# Altium project tcspc00.PrjPcb (part 1 of 2)
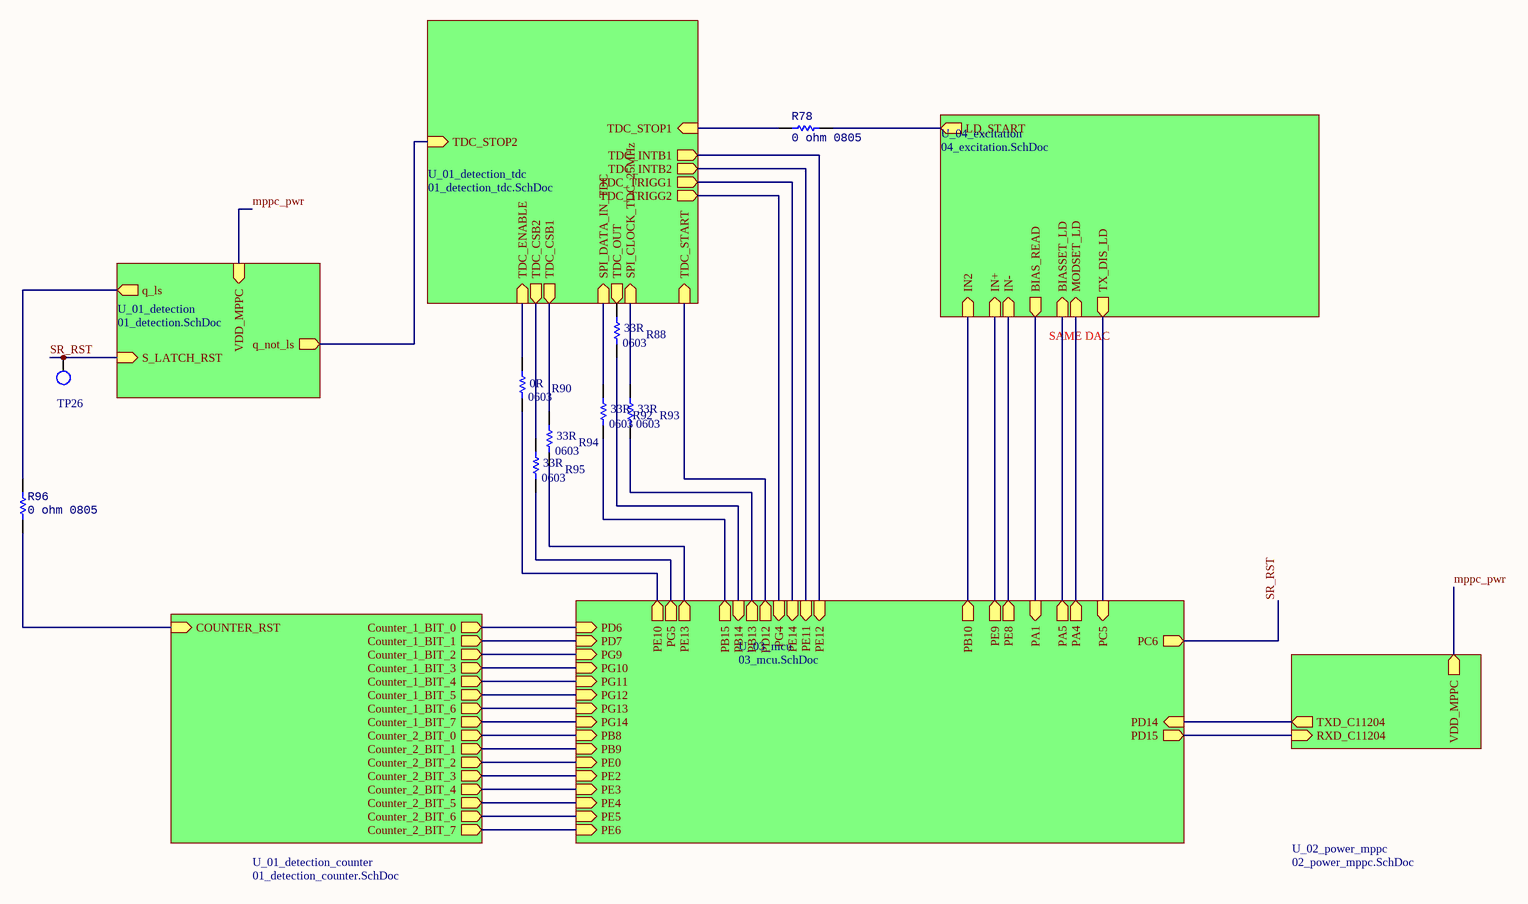
[diagram p0: 00_cover_sheet.SchDoc]
16 sheets, 354 parts. Net scope: hierarchical (ports join the sheet entries above them; power ports are global).
Board file: tcspc01.PcbDoc
Sheets:
  00_cover_sheet.SchDoc
    U_01_detection = 01_detection.SchDoc
    U_02_power_mppc = 02_power_mppc.SchDoc
    U_01_detection_tdc = 01_detection_tdc.SchDoc
    U_04_excitation = 04_excitation.SchDoc
    U_03_mcu = 03_mcu.SchDoc
      U_03_mcu_oscillators = 03_mcu_oscillators.SchDoc
      U_03_mcu_switches = 03_mcu_switches.SchDoc
      U_03_mcu_display = 03_mcu_display.SchDoc
      U_03_mcu_io = 03_mcu_io.SchDoc
      U_02_power_supply = 02_power_supply.SchDoc
        U_02_ldo1v8 = 02_ldo1v8.SchDoc
        U_02_boost3v3D = 02_boost3v3D.SchDoc
        U_02_boost5v = 02_boost5v.SchDoc
        U_02_ldo5v5 = 02_ldo5v5.SchDoc
    U_01_detection_counter = 01_detection_counter.SchDoc

## Sheet 00_cover_sheet.SchDoc
size A3; SheetNumber: 1; SheetTotal: 17

### Parts
R78  0 ohm 0805  [RES-STACK-POLE-0805]
R88  RMCF0603JT33R0  [RES-STACK-POLE-0603]  (value not drawn)
R90  RMCF0603ZT0R00  [RES-STACK-POLE-0603]  (value not drawn)
R92  RMCF0603JT33R0  [RES-STACK-POLE-0603]  (value not drawn)
R93  RMCF0603JT33R0  [RES-STACK-POLE-0603]  (value not drawn)
R94  RMCF0603JT33R0  [RES-STACK-POLE-0603]  (value not drawn)
R95  RMCF0603JT33R0  [RES-STACK-POLE-0603]  (value not drawn)
R96  0 ohm 0805  [RES-STACK-POLE-0805]
TP26  TESTPOINT_S  [TESTPOINT_S]  (value not drawn)  (no BOM)

### Sub-sheets
U_01_detection = 01_detection.SchDoc: VDD_MPPC (in), S_LATCH_RST (in), q_ls (out), q_not_ls (out)
U_01_detection_counter = 01_detection_counter.SchDoc: COUNTER_RST (in), Counter_1_BIT_0 (out), Counter_1_BIT_1 (out), Counter_1_BIT_2 (out), Counter_1_BIT_3 (out), Counter_1_BIT_4 (out), Counter_1_BIT_5 (out), Counter_1_BIT_6 (out), Counter_1_BIT_7 (out), Counter_2_BIT_0 (out), Counter_2_BIT_1 (out), Counter_2_BIT_2 (out), Counter_2_BIT_3 (out), Counter_2_BIT_4 (out), Counter_2_BIT_5 (out), Counter_2_BIT_6 (out), Counter_2_BIT_7 (out)
U_01_detection_tdc = 01_detection_tdc.SchDoc: TDC_ENABLE (in), SPI_CLOCK_TDC_25MHz (in), SPI_DATA_IN_TDC (in), TDC_INTB1 (out), TDC_INTB2 (out), TDC_TRIGG1 (out), TDC_TRIGG2 (out), TDC_CSB1 (out), TDC_CSB2 (out), TDC_STOP2 (in), TDC_STOP1 (in), TDC_START (in), TDC_OUT (out)
U_02_power_mppc = 02_power_mppc.SchDoc: RXD_C11204 (in), TXD_C11204 (out), VDD_MPPC (out)
U_03_mcu = 03_mcu.SchDoc: PE2 (in), PE3 (in), PE4 (in), PE5 (in), PE6 (in), PB10 (out), PE14 (in), PE13 (out), PE12 (in), PE11 (in), PE10 (out), PE9 (out), PE8 (out), PC5 (in), PA5 (out), PA4 (out), PB13 (out), PB14 (in), PB15 (out), PD12 (out), PD14 (in), PD15 (out), PG4 (in), PG5 (out), PC6 (out), PD6 (in), PD7 (in), PG9 (in), PG10 (in), PG11 (in), PG12 (in), PG13 (in), PG14 (in), PB8 (in), PB9 (in), PE0 (in), PA1 (in)
U_04_excitation = 04_excitation.SchDoc: MODSET_LD (in), BIASSET_LD (in), TX_DIS_LD (out), IN- (in), BIAS_READ (out), IN2 (in), IN+ (in), LD_START (out)

### Nets
Counter_1_BIT_0: sheet U_03_mcu/PD6, sheet U_01_detection_counter/Counter_1_BIT_0
Counter_1_BIT_1: sheet U_03_mcu/PD7, sheet U_01_detection_counter/Counter_1_BIT_1
Counter_1_BIT_2: sheet U_03_mcu/PG9, sheet U_01_detection_counter/Counter_1_BIT_2
Counter_1_BIT_3: sheet U_03_mcu/PG10, sheet U_01_detection_counter/Counter_1_BIT_3
Counter_1_BIT_4: sheet U_03_mcu/PG11, sheet U_01_detection_counter/Counter_1_BIT_4
Counter_1_BIT_5: sheet U_03_mcu/PG12, sheet U_01_detection_counter/Counter_1_BIT_5
Counter_1_BIT_6: sheet U_03_mcu/PG13, sheet U_01_detection_counter/Counter_1_BIT_6
Counter_1_BIT_7: sheet U_03_mcu/PG14, sheet U_01_detection_counter/Counter_1_BIT_7
Counter_2_BIT_0: sheet U_03_mcu/PB8, sheet U_01_detection_counter/Counter_2_BIT_0
Counter_2_BIT_1: sheet U_03_mcu/PB9, sheet U_01_detection_counter/Counter_2_BIT_1
Counter_2_BIT_2: sheet U_03_mcu/PE0, sheet U_01_detection_counter/Counter_2_BIT_2
Counter_2_BIT_3: sheet U_03_mcu/PE2, sheet U_01_detection_counter/Counter_2_BIT_3
Counter_2_BIT_4: sheet U_03_mcu/PE3, sheet U_01_detection_counter/Counter_2_BIT_4
Counter_2_BIT_5: sheet U_03_mcu/PE4, sheet U_01_detection_counter/Counter_2_BIT_5
Counter_2_BIT_6: sheet U_03_mcu/PE5, sheet U_01_detection_counter/Counter_2_BIT_6
Counter_2_BIT_7: sheet U_03_mcu/PE6, sheet U_01_detection_counter/Counter_2_BIT_7
COUNTER_RST: R96.1 ; sheet U_01_detection_counter/COUNTER_RST
mppc_pwr: sheet U_01_detection/VDD_MPPC, sheet U_02_power_mppc/VDD_MPPC
RXD_C11204: sheet U_02_power_mppc/RXD_C11204, sheet U_03_mcu/PD15
SPI_CLOCK_TDC_25MHz: R93.2 ; sheet U_01_detection_tdc/SPI_CLOCK_TDC_25MHz
SPI_DATA_IN_TDC: R92.2 ; sheet U_01_detection_tdc/SPI_DATA_IN_TDC
SR_RST: TP26.1 ; sheet U_01_detection/S_LATCH_RST, sheet U_03_mcu/PC6  [project net S_LATCH_RST]
TDC_CSB1: R94.2 ; sheet U_01_detection_tdc/TDC_CSB1
TDC_CSB2: R95.2 ; sheet U_01_detection_tdc/TDC_CSB2
TDC_ENABLE: R90.2 ; sheet U_01_detection_tdc/TDC_ENABLE
TDC_INTB1: sheet U_01_detection_tdc/TDC_INTB1, sheet U_03_mcu/PE12
TDC_INTB2: sheet U_01_detection_tdc/TDC_INTB2, sheet U_03_mcu/PE11
TDC_TRIGG1: sheet U_01_detection_tdc/TDC_TRIGG1, sheet U_03_mcu/PE14
TDC_TRIGG2: sheet U_01_detection_tdc/TDC_TRIGG2, sheet U_03_mcu/PG4
TXD_C11204: sheet U_02_power_mppc/TXD_C11204, sheet U_03_mcu/PD14
NetC103_1: sheet U_04_excitation/BIASSET_LD, sheet U_03_mcu/PA5
NetC105_1: sheet U_04_excitation/MODSET_LD, sheet U_03_mcu/PA4
NetR65_2: sheet U_04_excitation/BIAS_READ, sheet U_03_mcu/PA1
NetR67_2: sheet U_04_excitation/IN-, sheet U_03_mcu/PE8
NetR70_1: R78.2 ; sheet U_04_excitation/IN+, sheet U_04_excitation/LD_START, sheet U_03_mcu/PE9
NetR78_1: R78.1 ; sheet U_01_detection_tdc/TDC_STOP1
NetR82_1: sheet U_04_excitation/IN2, sheet U_03_mcu/PB10
NetR88_1: R88.1 ; sheet U_03_mcu/PB14
NetR88_2: R88.2 ; sheet U_01_detection_tdc/TDC_OUT
NetR90_1: R90.1 ; sheet U_03_mcu/PE10
NetR92_1: R92.1 ; sheet U_03_mcu/PB15
NetR93_1: R93.1 ; sheet U_03_mcu/PB13
NetR94_1: R94.1 ; sheet U_03_mcu/PE13
NetR95_1: R95.1 ; sheet U_03_mcu/PG5
NetR96_2: R96.2 ; sheet U_01_detection/q_ls
NetTP18_1: sheet U_01_detection/q_not_ls, sheet U_01_detection_tdc/TDC_STOP2
NetTP39_1: sheet U_01_detection_tdc/TDC_START, sheet U_03_mcu/PD12
NetU17_45: sheet U_04_excitation/TX_DIS_LD, sheet U_03_mcu/PC5

### Notes on the sheet
- SAME DAC
- (in symbol RMCF0603JT33R0) 33R; 0603
- (in symbol RMCF0603ZT0R00) 0R; 0603

### Library data of the parts
R78 R96 = RC0805JR-070RL: RES 0 OHM JUMPER 1/8W 0805; Supplier 1: Digikey; Supplier Part Number 1: 311-0.0ARCT-ND
R88 R92-R95 = RMCF0603JT33R0: RES 33 OHM 5% 1/10W 0603; Supplier 1: Digi-Key; Supplier Part Number 1: RMCF0603JT33R0CT-ND
R90 = RMCF0603ZT0R00: RES 0 OHM JUMPER 1/10W 0603; Supplier 1: Digi-Key; Supplier Part Number 1: RMCF0603ZT0R00CT-ND
TP26 = TESTPOINT_S: Testpoint Surface Pad

## Sheet 01_detection.SchDoc
size A3; SheetNumber: 2; SheetTotal: 17
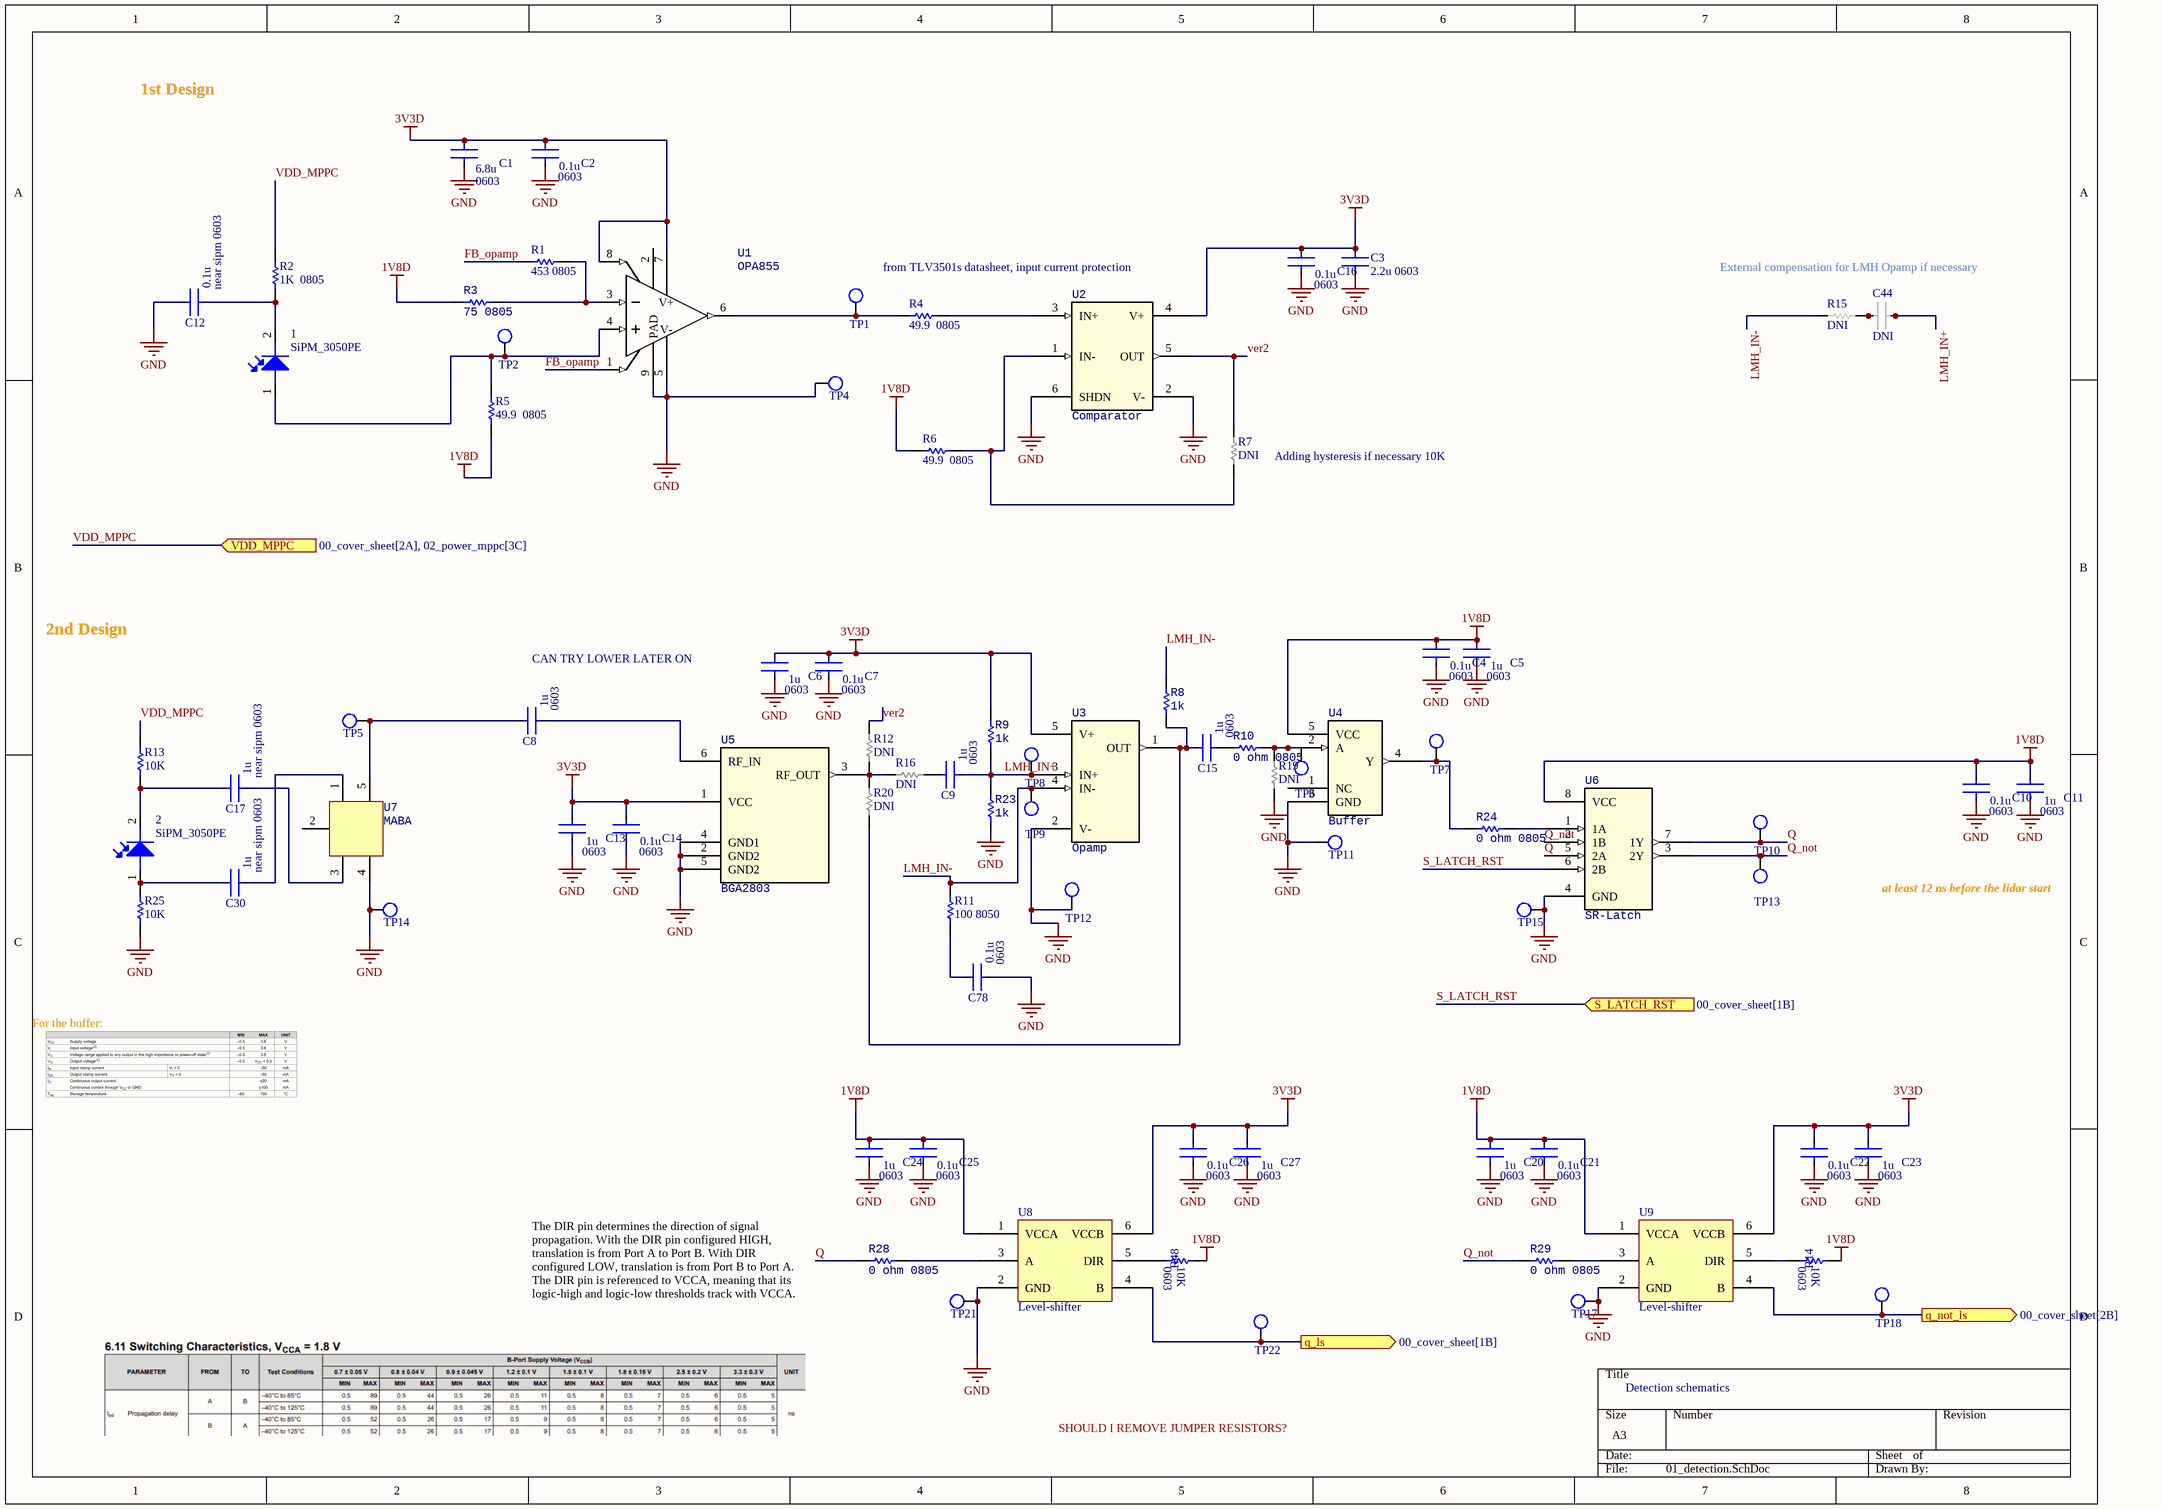
[diagram p1: 01_detection.SchDoc]

### Parts
1  SiPM_3050PE  [MPPC-S13360-3050PE]
2  SiPM_3050PE  [MPPC-S13360-3050PE]
C1  C1608X5R1E685K080AC  [CAPTDK0603]  (value not drawn)
C2  CGA3E2X7R1H104K080AA  [CAPTDK0603]  (value not drawn)
C3  2.2u 0603  [CAPTDK0603]
C4  CGA3E2X7R1H104K080AA  [CAPTDK0603]  (value not drawn)
C5  C1608X5R1E105K080AC  [CAPTDK0603]  (value not drawn)
C6  C1608X5R1E105K080AC  [CAPTDK0603]  (value not drawn)
C7  CGA3E2X7R1H104K080AA  [CAPTDK0603]  (value not drawn)
C8  C1608X5R1E105K080AC  [CAPTDK0603]  (value not drawn)
C9  C1608X5R1E105K080AC  [CAPTDK0603]  (value not drawn)
C10  CGA3E2X7R1H104K080AA  [CAPTDK0603]  (value not drawn)
C11  C1608X5R1E105K080AC  [CAPTDK0603]  (value not drawn)
C12  CL10B104KC8NNNC  [CAPTDK0603]  (value not drawn)
C13  C1608X5R1E105K080AC  [CAPTDK0603]  (value not drawn)
C14  CGA3E2X7R1H104K080AA  [CAPTDK0603]  (value not drawn)
C15  C1608X5R1E105K080AC  [CAPTDK0603]  (value not drawn)
C16  CGA3E2X7R1H104K080AA  [CAPTDK0603]  (value not drawn)
C17  GRM188D72A105KE01J  [CAPTDK0603]  (value not drawn)
C20  C1608X5R1E105K080AC  [CAPTDK0603]  (value not drawn)
C21  CGA3E2X7R1H104K080AA  [CAPTDK0603]  (value not drawn)
C22  CGA3E2X7R1H104K080AA  [CAPTDK0603]  (value not drawn)
C23  C1608X5R1E105K080AC  [CAPTDK0603]  (value not drawn)
C24  C1608X5R1E105K080AC  [CAPTDK0603]  (value not drawn)
C25  CGA3E2X7R1H104K080AA  [CAPTDK0603]  (value not drawn)
C26  CGA3E2X7R1H104K080AA  [CAPTDK0603]  (value not drawn)
C27  C1608X5R1E105K080AC  [CAPTDK0603]  (value not drawn)
C30  GRM188D72A105KE01J  [CAPTDK0603]  (value not drawn)
C44  DNI  [CAPTDK0603]  (no BOM)
C78  CGA3E2X7R1H104K080AA  [CAPTDK0603]  (value not drawn)
R1  453 0805  [RES-STACK-POLE-0805]
R2  1K  0805  [RES-STACK-POLE-0805]
R3  75 0805  [RES-STACK-POLE-0805]
R4  49.9  0805  [RES-STACK-POLE-0805]
R5  49.9  0805  [RES-STACK-POLE-0805]
R6  49.9  0805  [RES-STACK-POLE-0805]
R7  DNI  [RES-STACK-POLE-0805]
R8  1k  [RES_0603]
R9  1k  [RES_0603]
R10  0 ohm 0805  [RES-STACK-POLE-0805]
R11  100 8050  [RES-STACK-POLE-0805]
R12  DNI  [RES-STACK-POLE-0805]
R13  10K  [RES-STACK-POLE-0805]
R14  RMCF0603JG10K0  [RES-STACK-POLE-0603]  (value not drawn)
R15  DNI  [RES_0603]
R16  DNI  [RES-STACK-POLE-0805]
R19  DNI  [RES-STACK-POLE-0805]
R20  DNI  [RES-STACK-POLE-0805]
R23  1k  [RES_0603]
R24  0 ohm 0805  [RES-STACK-POLE-0805]
R25  10K  [RES-STACK-POLE-0805]
R28  0 ohm 0805  [RES-STACK-POLE-0805]
R29  0 ohm 0805  [RES-STACK-POLE-0805]
R48  RMCF0603JG10K0  [RES-STACK-POLE-0603]  (value not drawn)
TP1  TESTPOINT_S  [TESTPOINT_S]  (value not drawn)  (no BOM)
TP2  TESTPOINT_S  [TESTPOINT_S]  (value not drawn)  (no BOM)
TP4  TESTPOINT_S  [TESTPOINT_S]  (value not drawn)  (no BOM)
TP5  TESTPOINT_S  [TESTPOINT_S]  (value not drawn)  (no BOM)
TP6  TESTPOINT_S  [TESTPOINT_S]  (value not drawn)  (no BOM)
TP7  TESTPOINT_S  [TESTPOINT_S]  (value not drawn)  (no BOM)
TP8  TESTPOINT_S  [TESTPOINT_S]  (value not drawn)  (no BOM)
TP9  TESTPOINT_S  [TESTPOINT_S]  (value not drawn)  (no BOM)
TP10  TESTPOINT_S  [TESTPOINT_S]  (value not drawn)  (no BOM)
TP11  TESTPOINT_S  [TESTPOINT_S]  (value not drawn)  (no BOM)
TP12  TESTPOINT_S  [TESTPOINT_S]  (value not drawn)  (no BOM)
TP13  TESTPOINT_S  [TESTPOINT_S]  (value not drawn)  (no BOM)
TP14  TESTPOINT_S  [TESTPOINT_S]  (value not drawn)  (no BOM)
TP15  TESTPOINT_S  [TESTPOINT_S]  (value not drawn)  (no BOM)
TP17  TESTPOINT_S  [TESTPOINT_S]  (value not drawn)  (no BOM)
TP18  TESTPOINT_S  [TESTPOINT_S]  (value not drawn)  (no BOM)
TP21  TESTPOINT_S  [TESTPOINT_S]  (value not drawn)  (no BOM)
TP22  TESTPOINT_S  [TESTPOINT_S]  (value not drawn)  (no BOM)
U1  OPA855  [WSON-08]
U2  Comparator  [SOT-23]
U3  Opamp  [MF05A-L]
U4  Buffer  [DBV0005A]
U5  BGA2803  [SOT_02,115_NXP-M]
U6  SR-Latch  [DCU0008A]
U7  MABA  [MABA-007159-]
U8  Level-shifter  [SON50P100X60-6N]
U9  Level-shifter  [SON50P100X60-6N]

### Ports
q_ls (out, see 00_cover_sheet[1B]), q_not_ls (out, see 00_cover_sheet[2B]), S_LATCH_RST (in, see 00_cover_sheet[1B]), VDD_MPPC (in, see 00_cover_sheet[2A], 02_power_mppc[3C])

### Nets
1V8D: C4.1 C5.1 C10.1 C11.1 C20.1 C21.1 C24.1 C25.1 R3.1 R5.1 R6.1 R14.2 R48.2 U4.5(VCC) U6.8(VCC) U8.1(VCCA) U9.1(VCCA)
3V3D: C1.1 C2.1 C3.1 C6.1 C7.1 C13.1 C14.1 C16.1 C22.1 C23.1 C26.1 C27.1 R9.2 U1.7(VS+) U1.8(PD_N) U2.4(V+) U3.5(V+) U5.1(VCC) U8.6(VCCB) U9.6(VCCB)
GND: C1.2 C2.2 C3.2 C4.2 C5.2 C6.2 C7.2 C10.2 C11.2 C12.1 C13.2 C14.2 C16.2 C20.2 C21.2 C22.2 C23.2 C24.2 C25.2 C26.2 C27.2 C78.2 R19.1 R23.1 R25.1 TP4.1 TP11.1 TP12.1 TP14.1 TP15.1 TP17.1 TP21.1 U1.5(VS-) U1.9(PAD) U2.2(V-) U2.6(SHDN) U3.2(V-) U4.3(GND) U5.2(GND2) U5.4(GND1) U5.5(GND2) U6.4(GND) U7.4 U8.2(GND) U9.2(GND)
FB_opamp: R1.1 U1.1(FB)
LMH_IN+: C9.2 C44.2 R9.1 R23.2 TP8.1 U3.3(IN+)
LMH_IN-: R8.2 R11.2 R15.1 TP9.1 U3.4(IN-)
Q: R28.1 TP10.1 U6.5(2A) U6.7(1Y)
Q_not: R29.1 TP13.1 U6.2(1B) U6.3(2Y)
S_LATCH_RST: U6.6(2B) ; port S_LATCH_RST
VDD_MPPC: R2.2 R13.2 ; port VDD_MPPC  [project net mppc_pwr]
ver2: R7.2 R12.2 U2.5(OUT)
Net1_1: 1.1 R5.2 TP2.1 U1.4(IN+)
Net1_2: 1.2 C12.2 R2.1
Net2_1: 2.1 C30.1 R25.2
Net2_2: 2.2 C17.1 R13.1
NetC8_1: C8.1 TP5.1 U7.5
NetC8_2: C8.2 U5.6(RF_IN)
NetC9_1: C9.1 R16.2
NetC15_1: C15.1 R8.1 R20.1 U3.1(OUT)
NetC15_2: C15.2 R10.1
NetC17_2: C17.2 U7.3
NetC30_2: C30.2 U7.1
NetC44_1: C44.1 R15.2
NetC78_1: C78.1 R11.1
NetR1_2: R1.2 R3.2 U1.3(IN-)
NetR4_1: R4.1 TP1.1 U1.6(OUT)
NetR4_2: R4.2 U2.3(IN+)
NetR6_2: R6.2 R7.1 U2.1(IN-)
NetR10_2: R10.2 R19.2 TP6.1 U4.2(A)
NetR12_1: R12.1 R16.1 R20.2 U5.3(RF_OUT)
NetR14_1: R14.1 U9.5(DIR)
NetR24_1: R24.1 TP7.1 U4.4(Y)
NetR24_2: R24.2 U6.1(1A)
NetR28_2: R28.2 U8.3(A)
NetR29_2: R29.2 U9.3(A)
NetR48_1: R48.1 U8.5(DIR)
NetR96_2: TP22.1 U8.4(B) ; port q_ls
NetTP18_1: TP18.1 U9.4(B) ; port q_not_ls

Not connected (* = marked no-connect by the designer): U1 2(NC); U4 1(NC); U7 2

### Notes on the sheet
- 1st Design
- from TLV3501s datasheet, input current protection
- External compensation for LMH Opamp if necessary
- (near R7) Adding hysteresis if necessary 10K
- 2nd Design
- CAN TRY LOWER LATER ON
- at least 12 ns before the lidar start
- For the buffer:
- The DIR pin determines the direction of signal
  propagation. With the DIR pin configured HIGH,
  translation is from Port A to Port B. With DIR
  configured LOW, translation is from Port B to Port A.
  The DIR pin is referenced to VCCA, meaning that its
  logic-high and logic-low thresholds track with VCCA.
- Detection schematics
- SHOULD I REMOVE JUMPER RESISTORS?
- (in symbol C1608X5R1E105K080AC) 1u; 0603
- (in symbol C1608X5R1E685K080AC) 6.8u; 0603
- (in symbol CGA3E2X7R1H104K080AA) 0.1u; 0603
- (in symbol CL10B104KC8NNNC) 0.1u; near sipm 0603
- (in symbol GRM188D72A105KE01J) 1u; near sipm 0603
- (in symbol OPA855) V+; V-
- (in symbol RMCF0603JG10K0) 0603; 10K

### Library data of the parts
C1 = C1608X5R1E685K080AC: CAP CER 6.8UF 25V X5R 0603; Supplier 1: Digikey; Supplier Part Number 1: 445-14145-1-ND
C2 C4 C7 C10 C14 C16 C21 C22 C25 C26 C78 = CGA3E2X7R1H104K080AA: CAP CER 0.1UF 50V X7R 0603; Supplier 1: Digi-Key; Supplier Part Number 1: 445-5666-1-ND
C3 = C1608X5R1E225K080AB: CAP CER 2.2UF 25V X5R 0603; Supplier 1: Digikey; Supplier Part Number 1: 445-5964-1-ND
C5 C6 C8 C9 C11 C13 C15 C20 C23 C24 C27 = C1608X5R1E105K080AC: CAP CER 1UF 25V X5R 0603; Supplier 1: Digi-Key; Supplier Part Number 1: 445-5146-1-ND
C12 = CL10B104KC8NNNC: CAP CER 0.1UF 100V X7R 0603; Supplier 1: Digikey; Supplier Part Number 1: 1276-6807-1-ND
C17 C30 = GRM188D72A105KE01J: CAP CER 1UF 100V X7T 0603; Supplier 1: Digikey; Supplier Part Number 1: 490-GRM188D72A105KE01JCT-ND
C44 = C0402_PROVISION: CAP PROVISION 0603; Value: DNI
R1 = RK73H2ATTD4530F: RES 453 OHM 1% 1/4W 0805; Supplier 1: Digikey; Supplier Part Number 1: 2019-RK73H2ATTD4530FCT-ND
R2 = RK73H2ATTD1001F: RES 1K OHM 1% 1/4W 0805; Supplier 1: Digikey; Supplier Part Number 1: 2019-RK73H2ATTD1001FCT-ND
R3 = RK73H2ATTD75R0F: RES 75 OHM 1% 1/4W 0805; Supplier 1: Digikey; Supplier Part Number 1: 2019-RK73H2ATTD75R0FCT-ND
R4-R6 = RK73H2ATTD49R9F: RES 49.9 OHM 1% 1/4W 0805; Supplier 1: Digikey; Supplier Part Number 1: 2019-RK73H2ATTD49R9FCT-ND
R7 R12 R16 R19 R20 = R0805: RES DNI 0805
R8 R9 R23 = RMCF0603FT1K00: RES 1K OHM 1% 1/10W 0603; Manufacturer: Stackpole Electronics; Resistance: 1kR; Power Rating: 100mW; Temperature Coefficient: 100ppm/°C; Supplier 1: Digi-Key; Manufacturer Part Number: RMCF0603FT1K00; RoHS: Yes; Category: Chip SMD Resistors; Stock 1: 5784598; Pricing 1: 5000=0.00218 (USD); Mount: Surface Mount; Case/Package: 0603; Case Code (Metric): 1608; Case Code (Imperial): 0603; Contact Plating: Tin,Matte; Size Code: 0603; Min Operating Temperature: -55°C; Max Operating Temperature: 155°C; Packaging: Tape and Reel; Tolerance: 1%; Series: RMCF; Resistor Type: Thick Film; Number of Terminations: 2; Max Power Dissipation: 100mW; Features: Automotive AEC-Q200; Construction: Rectangular; Length: 1.55mm; Width: 0.031inch; Height: 0.022inch; Depth: 0.8mm; Radiation Hardening: No; Military Standard: Not; Lead Free: Lead Free; RoHS Compliant: Yes; ComponentLink1URL: https://www.seielect.com/catalog/sei-rmcf_rmcp.pdf?src-supplier=Digi-Key; ComponentLink1Description: https://www.seielect.com/catalog/sei-rmcf_rmcp.pdf?src-supplier=Digi-Key; ComponentLink2URL: https://www.seielect.com/catalog/SEI-RMCF_RMCP.pdf?src-supplier=Avnet; ComponentLink2Description: https://www.seielect.com/catalog/SEI-RMCF_RMCP.pdf?src-supplier=Avnet; ComponentLink3URL: https://www.seielect.com/catalog/SEI-Packaging.pdf?src-supplier=Avnet; ComponentLink3Description: https://www.seielect.com/catalog/SEI-Packaging.pdf?src-supplier=Avnet; ComponentLink4URL: https://www.seielect.com/catalog/SEI-Packaging.pdf?src-supplier=Arrow+Electronics; ComponentLink4Description: https://www.seielect.com/catalog/SEI-Packaging.pdf?src-supplier=Arrow+Electronics; ComponentLink5URL: https://www.seielect.com/catalog/SEI-RMCF_RMCP.pdf?src-supplier=Avnet+Asia; ComponentLink5Description: https://www.seielect.com/catalog/SEI-RMCF_RMCP.pdf?src-supplier=Avnet+Asia; ComponentLink6URL: http://www.seielect.com/Catalog/SEI-rmc.pdf?src-supplier=Future+Electronics; ComponentLink6Description: http://www.seielect.com/Catalog/SEI-rmc.pdf?src-supplier=Future+Electronics; ComponentLink7URL: https://www.seielect.com/catalog/SEI-Packaging.pdf?src-supplier=Verical; ComponentLink7Description: https://www.seielect.com/catalog/SEI-Packaging.pdf?src-supplier=Verical; ComponentLink8URL: https://www.seielect.com/catalog/SEI-Packaging.pdf?src-supplier=Quest; ComponentLink8Description: https://www.seielect.com/catalog/SEI-Packaging.pdf?src-supplier=Quest; Supplier Part Number 1: RMCF0603FT1K00TR-ND
R10 R24 R28 R29 = RC0805JR-070RL: RES 0 OHM JUMPER 1/8W 0805; Supplier 1: Digikey; Supplier Part Number 1: 311-0.0ARCT-ND
R11 = RK73H2AT1000F: RK73H2ATK001KIT %1 tolerance 100 ohm resistor 8050 package
R13 R25 = RK73H2ATTD1002F: RES 10K OHM 1% 1/4W 0805; Supplier 1: Digikey; Supplier Part Number 1: 2019-RK73H2ATTD1002FCT-ND
R14 R48 = RMCF0603JG10K0: RES 10K OHM 5% 1/10W 0603; Supplier 1: Digi-Key; Supplier Part Number 1: 738-RMCF0603JG10K0CT-ND
R15 = R0603: RES DNI 0603
TP1 TP2 TP4-TP15 TP17 TP18 TP21 TP22 = TESTPOINT_S: Testpoint Surface Pad
U1 = OPA855: IC OPAMP GP 1 CIRCUIT 8WSON; Supplier 1: Digikey; Supplier Part Number 1: 296-53158-1-ND
U2 = TLV35011AIDBVT: IC COMPARATOR 1 GEN PUR SOT23-6; Supplier 1: Digikey; Supplier Part Number 1: 296-18248-1-ND
U3 = LMH6629MFE/NOPB: IC OPAMP VFB 1 CIRCUIT SOT23-5; Supplier 1: Digikey; Supplier Part Number 1: LMH6629MFE/NOPBCT-ND
U4 = SN74AUC1G17DBVR: IC BUF NON-INVERT 2.7V SOT23-5; Supplier 1: Digikey; Supplier Part Number 1: 296-12654-1-ND
U5 = BGA2803: IC RF AMP GPS 0HZ-2.2GHZ 6TSSOP; Supplier 1: Digikey; Supplier Part Number 1: 568-8483-1-ND
U6 = SN74AUC2G02DCUR: 2-ch, 2-input, 0.8-V to 2.7-V high speed NOR gates; Supplier 1: Digikey; Supplier Part Number 1: 296-18570-1-ND
U7 = MABA-007159: BALUN 4.5MHZ-3GHZ 1:1 6SMD FLAT; Supplier 1: Digikey; Supplier Part Number 1: 1465-1302-1-ND
U8 U9 = SN74AXCH1T45DRY2: IC TRANSLTR BIDIRECTIONAL 6SON SN74AXCH1T45DRY2 texas instruments; Supplier 1: Digikey; Supplier Part Number 1: 296-SN74AXCH1T45DRY2CT-ND

## Sheet 02_power_mppc.SchDoc
size A; SheetNumber: 4; SheetTotal: 17
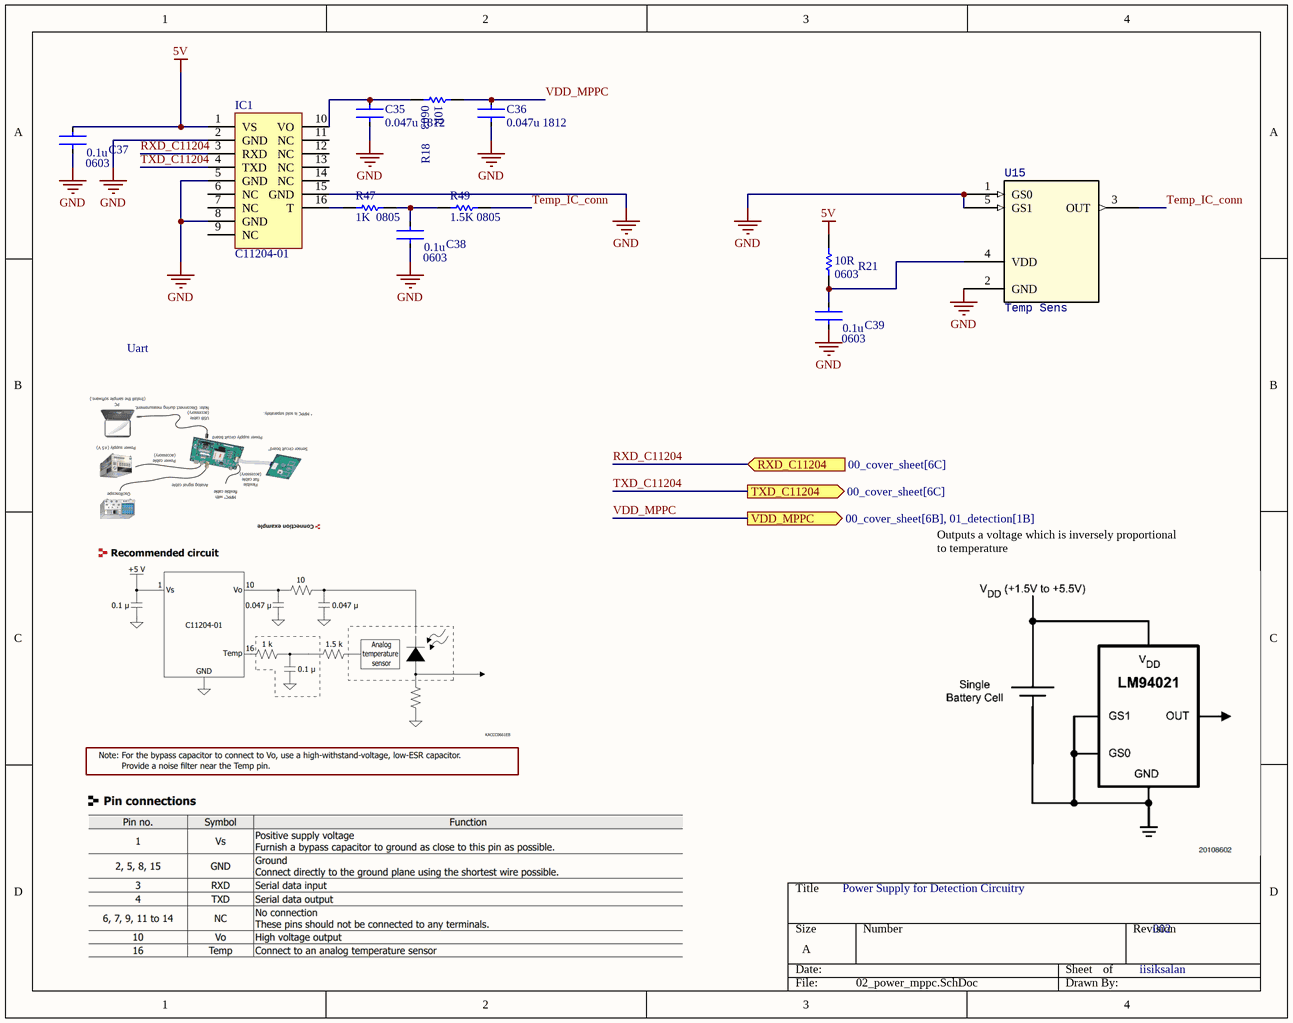
[diagram p2: 02_power_mppc.SchDoc]

### Parts
C35  0.047u 1812  [1812]
C36  0.047u 1812  [1812]
C37  CGA3E2X7R1H104K080AA  [CAPTDK0603]  (value not drawn)
C38  CGA3E2X7R1H104K080AA  [CAPTDK0603]  (value not drawn)
C39  CGA3E2X7R1H104K080AA  [CAPTDK0603]  (value not drawn)
IC1  C11204-01  [MPPC_POWER_C11204-01]
R18  RMCF0603FT10R0  [RES-STACK-POLE-0603]  (value not drawn)
R21  RMCF0603FT10R0  [RES-STACK-POLE-0603]  (value not drawn)
R47  1K  0805  [RES-STACK-POLE-0805]
R49  1.5K 0805  [RES-STACK-POLE-0805]
U15  Temp Sens  [SOT-1.1]

### Ports
RXD_C11204 (in, see 00_cover_sheet[6C]), TXD_C11204 (out, see 00_cover_sheet[6C]), VDD_MPPC (out, see 00_cover_sheet[6B], 01_detection[1B])

### Nets
5V: C37.1 IC1.1(VS) R21.2  [project net VREG]
GND: C35.2 C36.2 C37.2 C38.2 C39.2 IC1.2(GND) IC1.5(GND) IC1.8(GND) IC1.15(GND) U15.1(GS0) U15.2(GND) U15.5(GS1)
RXD_C11204: IC1.3(RXD) ; port RXD_C11204
Temp_IC_conn: R49.2 U15.3(OUT)
TXD_C11204: IC1.4(TXD) ; port TXD_C11204
VDD_MPPC: C36.1 R18.2 ; port VDD_MPPC  [project net mppc_pwr]
NetC35_1: C35.1 IC1.10(VO) R18.1
NetC38_1: C38.1 R47.2 R49.1
NetC39_1: C39.1 R21.1 U15.4(VDD)
NetIC1_16: IC1.16(T) R47.1

Not connected (* = marked no-connect by the designer): IC1 6(NC) 7(NC) 9(NC) 11(NC) 12(NC) 13(NC) 14(NC)

### Notes on the sheet
- Uart
- Outputs a voltage which is inversely proportional
  to temperature
- Power Supply for Detection Circuitry
- iisiksalan
- 002
- (in symbol CGA3E2X7R1H104K080AA) 0.1u; 0603
- (in symbol RMCF0603FT10R0) 0603; 10R

### Library data of the parts
C35 C36 = C1812C473F1GAC7800: CAP CER 0.047UF 100V C0GNP0 1812; Supplier 1: Digikey; Supplier Part Number 1: 399-C1812C473F1GAC7800CT-ND
C37-C39 = CGA3E2X7R1H104K080AA: CAP CER 0.1UF 50V X7R 0603; Supplier 1: Digi-Key; Supplier Part Number 1: 445-5666-1-ND
IC1 = MPPC-Power: MPPC Hamamutsa Power IC
R18 R21 = RMCF0603FT10R0: RES 10 OHM 1% 1/10W 0603; Supplier 1: Digi-Key; Supplier Part Number 1: RMCF0603FT10R0CT-ND
R47 = RK73H2ATTD1001F: RES 1K OHM 1% 1/4W 0805; Supplier 1: Digikey; Supplier Part Number 1: 2019-RK73H2ATTD1001FCT-ND
R49 = RK73H2ATTD1501F: RES 1.5K OHM 1% 1/4W 0805; Supplier 1: Digikey; Supplier Part Number 1: 2019-RK73H2ATTD1501FCT-ND
U15 = LM94021BIMGX/NOPB: SENSOR ANALOG -50C-150C SC70-5; Supplier 1: Digikey; Supplier Part Number 1: LM94021BIMGX/NOPBCT-ND

## Sheet 01_detection_tdc.SchDoc
size A; SheetNumber: 17; SheetTotal: 17
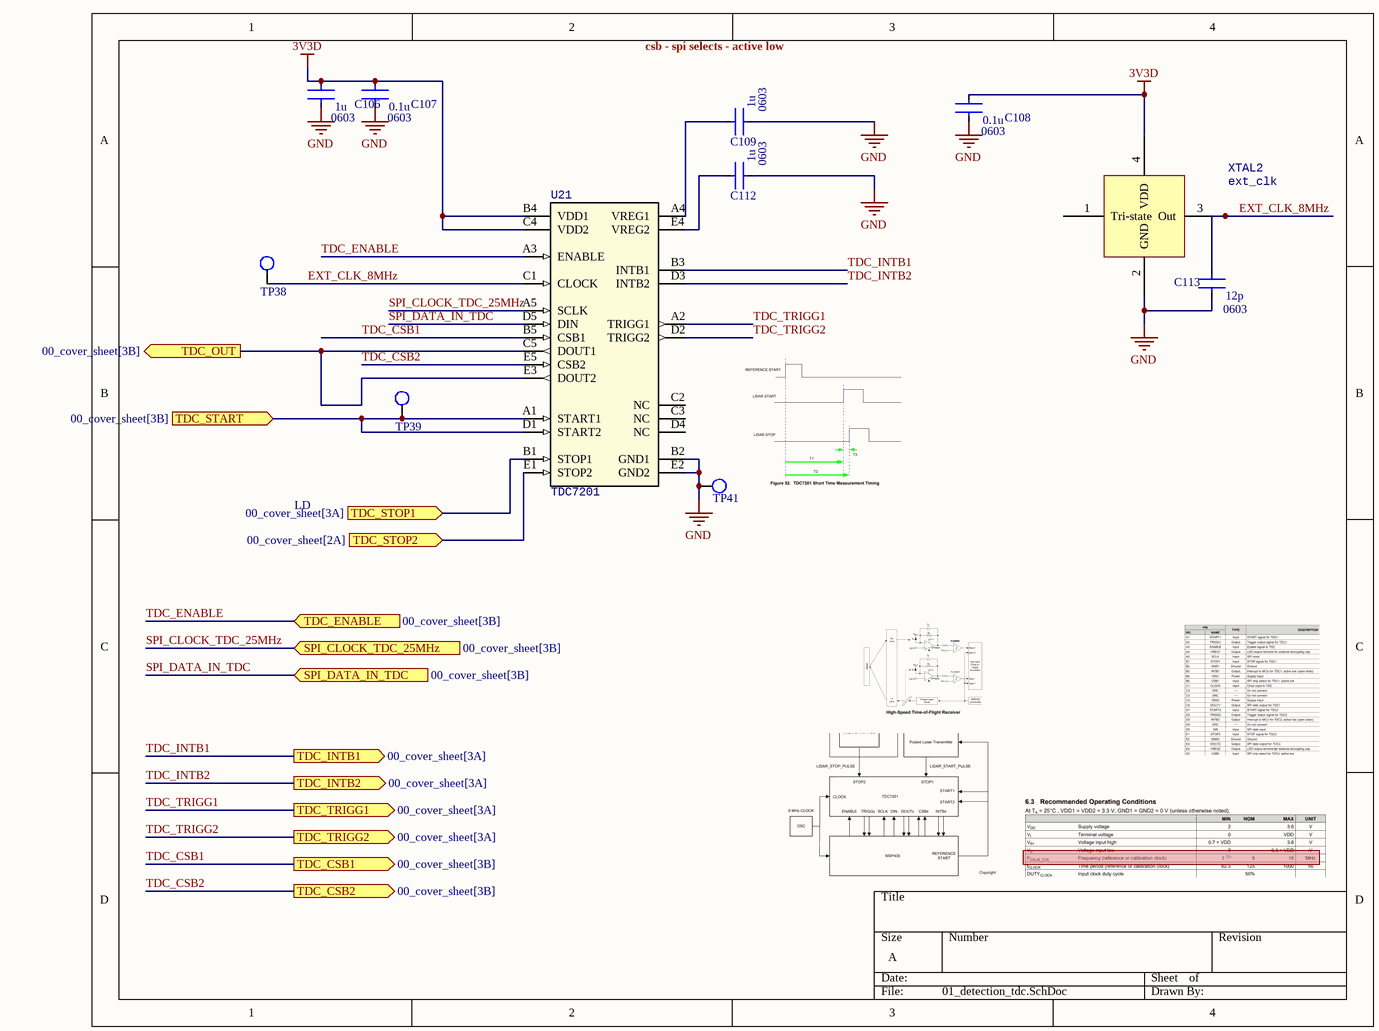
[diagram p3: 01_detection_tdc.SchDoc]

### Parts
C106  C1608X5R1E105K080AC  [CAPTDK0603]  (value not drawn)
C107  CGA3E2X7R1H104K080AA  [CAPTDK0603]  (value not drawn)
C108  CGA3E2X7R1H104K080AA  [CAPTDK0603]  (value not drawn)
C109  C1608X5R1E105K080AC  [CAPTDK0603]  (value not drawn)
C112  C1608X5R1E105K080AC  [CAPTDK0603]  (value not drawn)
C113  CGA3E2C0G1H120J080AA  [CAPTDK0603]  (value not drawn)
TP38  TESTPOINT_S  [TESTPOINT_S]  (value not drawn)  (no BOM)
TP39  TESTPOINT_S  [TESTPOINT_S]  (value not drawn)  (no BOM)
TP41  TESTPOINT_S  [TESTPOINT_S]  (value not drawn)  (no BOM)
U21  TDC7201  [ZAX0025A]
XTAL2  ext_clk  [ECS-2520MV]

### Ports
SPI_CLOCK_TDC_25MHz (in, see 00_cover_sheet[3B]), SPI_DATA_IN_TDC (in, see 00_cover_sheet[3B]), TDC_CSB1 (out, see 00_cover_sheet[3B]), TDC_CSB2 (out, see 00_cover_sheet[3B]), TDC_ENABLE (in, see 00_cover_sheet[3B]), TDC_INTB1 (out, see 00_cover_sheet[3A]), TDC_INTB2 (out, see 00_cover_sheet[3A]), TDC_OUT (out, see 00_cover_sheet[3B]), TDC_START (in, see 00_cover_sheet[3B]), TDC_STOP1 (in, see 00_cover_sheet[3A]), TDC_STOP2 (in, see 00_cover_sheet[2A]), TDC_TRIGG1 (out, see 00_cover_sheet[3A]), TDC_TRIGG2 (out, see 00_cover_sheet[3A])

### Nets
3V3D: C106.1 C107.1 C108.1 U21.B4(VDD1) U21.C4(VDD2) XTAL2.4(VDD)
GND: C106.2 C107.2 C108.2 C109.2 C112.2 C113.2 TP41.1 U21.B2(GND1) U21.E2(GND2) XTAL2.2(GND)
EXT_CLK_8MHz: C113.1 TP38.1 U21.C1(CLOCK) XTAL2.3(Out)
SPI_CLOCK_TDC_25MHz: U21.A5(SCLK) ; port SPI_CLOCK_TDC_25MHz
SPI_DATA_IN_TDC: U21.D5(DIN) ; port SPI_DATA_IN_TDC
TDC_CSB1: U21.B5(CSB1) ; port TDC_CSB1
TDC_CSB2: U21.E5(CSB2) ; port TDC_CSB2
TDC_ENABLE: U21.A3(ENABLE) ; port TDC_ENABLE
TDC_INTB1: U21.B3(INTB1) ; port TDC_INTB1
TDC_INTB2: U21.D3(INTB2) ; port TDC_INTB2
TDC_TRIGG1: U21.A2(TRIGG1) ; port TDC_TRIGG1
TDC_TRIGG2: U21.D2(TRIGG2) ; port TDC_TRIGG2
NetC109_1: C109.1 U21.A4(VREG1)
NetC112_1: C112.1 U21.E4(VREG2)
NetR78_1: U21.B1(STOP1) ; port TDC_STOP1
NetR88_2: U21.C5(DOUT1) U21.E3(DOUT2) ; port TDC_OUT
NetTP18_1: U21.E1(STOP2) ; port TDC_STOP2
NetTP39_1: TP39.1 U21.A1(START1) U21.D1(START2) ; port TDC_START

Not connected (* = marked no-connect by the designer): U21 C2(NC) C3(NC) D4(NC); XTAL2 1(Tri-state)

### Notes on the sheet
- csb - spi selects - active low
- LD
- (in symbol C1608X5R1E105K080AC) 1u; 0603
- (in symbol CGA3E2C0G1H120J080AA) 12p; 0603
- (in symbol CGA3E2X7R1H104K080AA) 0.1u; 0603

### Library data of the parts
C106 C109 C112 = C1608X5R1E105K080AC: CAP CER 1UF 25V X5R 0603; Supplier 1: Digi-Key; Supplier Part Number 1: 445-5146-1-ND
C107 C108 = CGA3E2X7R1H104K080AA: CAP CER 0.1UF 50V X7R 0603; Supplier 1: Digi-Key; Supplier Part Number 1: 445-5666-1-ND
C113 = CGA3E2C0G1H120J080AA: CAP CER 12PF 50V C0G 0603; Supplier 1: Digi-Key; Supplier Part Number 1: 445-5629-1-ND
TP38 TP39 TP41 = TESTPOINT_S: Testpoint Surface Pad
U21 = TDC7201: IC TIME TO DIGITAL CONV 25-NFBGA; Supplier 1: Digikey; Supplier Part Number 1: 296-48679-1-ND
XTAL2 = ECS-2520MV-160-CN-TR: OSC XO 16.0000MHZ CMOS SMD; Supplier 1: Digikey; Supplier Part Number 1: XC3030CT-ND

## Sheet 04_excitation.SchDoc
size A3; SheetNumber: 16; SheetTotal: 17
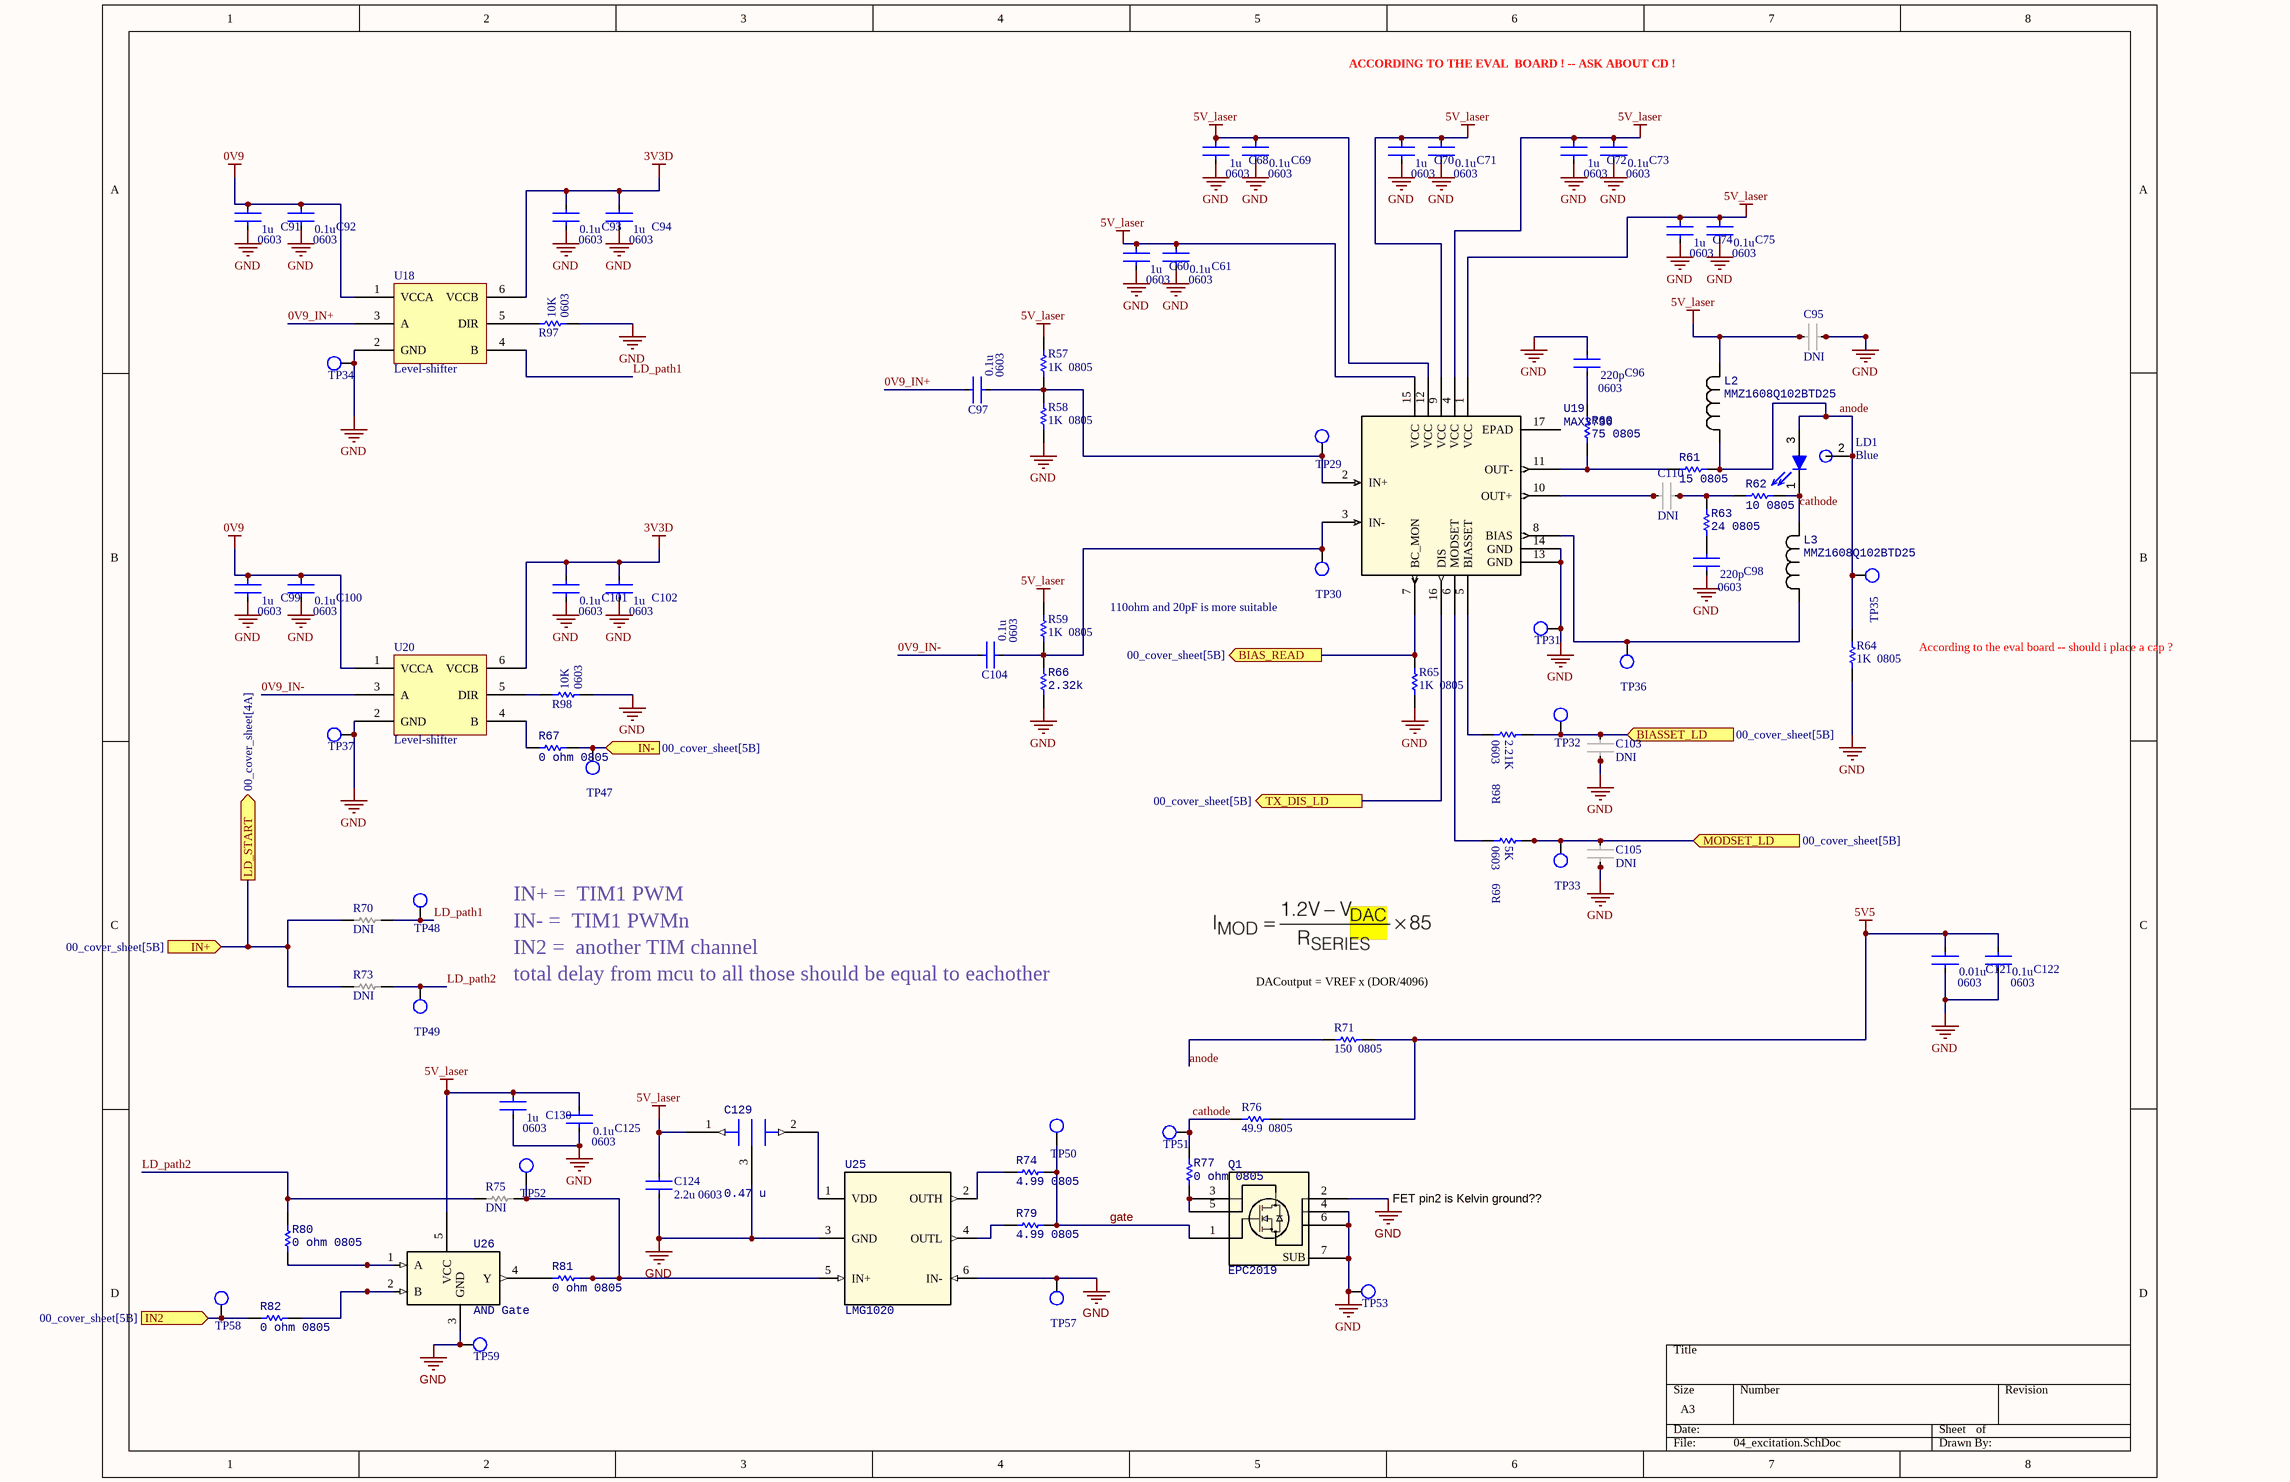
[diagram p4: 04_excitation.SchDoc]

### Parts
C60  C1608X5R1E105K080AC  [CAPTDK0603]  (value not drawn)
C61  CGA3E2X7R1H104K080AA  [CAPTDK0603]  (value not drawn)
C68  C1608X5R1E105K080AC  [CAPTDK0603]  (value not drawn)
C69  CGA3E2X7R1H104K080AA  [CAPTDK0603]  (value not drawn)
C70  C1608X5R1E105K080AC  [CAPTDK0603]  (value not drawn)
C71  CGA3E2X7R1H104K080AA  [CAPTDK0603]  (value not drawn)
C72  C1608X5R1E105K080AC  [CAPTDK0603]  (value not drawn)
C73  CGA3E2X7R1H104K080AA  [CAPTDK0603]  (value not drawn)
C74  C1608X5R1E105K080AC  [CAPTDK0603]  (value not drawn)
C75  CGA3E2X7R1H104K080AA  [CAPTDK0603]  (value not drawn)
C91  C1608X5R1E105K080AC  [CAPTDK0603]  (value not drawn)
C92  CGA3E2X7R1H104K080AA  [CAPTDK0603]  (value not drawn)
C93  CGA3E2X7R1H104K080AA  [CAPTDK0603]  (value not drawn)
C94  C1608X5R1E105K080AC  [CAPTDK0603]  (value not drawn)
C95  DNI  [CAPTDK0603]  (no BOM)
C96  C0603C221K5RAC7867  [CAPTDK0603]  (value not drawn)
C97  CGA3E2X7R1H104K080AA  [CAPTDK0603]  (value not drawn)
C98  C0603C221K5RAC7867  [CAPTDK0603]  (value not drawn)
C99  C1608X5R1E105K080AC  [CAPTDK0603]  (value not drawn)
C100  CGA3E2X7R1H104K080AA  [CAPTDK0603]  (value not drawn)
C101  CGA3E2X7R1H104K080AA  [CAPTDK0603]  (value not drawn)
C102  C1608X5R1E105K080AC  [CAPTDK0603]  (value not drawn)
C103  DNI  [CAPTDK0603]  (no BOM)
C104  CGA3E2X7R1H104K080AA  [CAPTDK0603]  (value not drawn)
C105  DNI  [CAPTDK0603]  (no BOM)
C110  DNI  [CAPTDK0603]  (no BOM)
C121  C0603C103J5RACTU  [CAPTDK0603]  (value not drawn)
C122  CGA3E2X7R1H104K080AA  [CAPTDK0603]  (value not drawn)
C124  2.2u 0603  [CAPTDK0603]
C125  CGA3E2X7R1H104K080AA  [CAPTDK0603]  (value not drawn)
C129  0.47 u  [YFF18PW]
C130  C1608X5R1E105K080AC  [CAPTDK0603]  (value not drawn)
L2  MMZ1608Q102BTD25  [IND_TDK_MMZ1608_TDK]
L3  MMZ1608Q102BTD25  [IND_TDK_MMZ1608_TDK]
LD1  Blue  [LS56HBSM1]
Q1  EPC2019  [EPC2019_ECC]
R57  1K  0805  [RES-STACK-POLE-0805]
R58  1K  0805  [RES-STACK-POLE-0805]
R59  1K  0805  [RES-STACK-POLE-0805]
R60  75 0805  [RES-STACK-POLE-0805]
R61  15 0805  [RES-STACK-POLE-0805]
R62  10 0805  [RES-STACK-POLE-0805]
R63  24 0805  [RES-STACK-POLE-0805]
R64  1K  0805  [RES-STACK-POLE-0805]
R65  1K  0805  [RES-STACK-POLE-0805]
R66  2.32k  [RES-STACK-POLE-0805]
R67  0 ohm 0805  [RES-STACK-POLE-0805]
R68  RMCF0603FT2K21  [RES-STACK-POLE-0603]  (value not drawn)
R69  RT0603BRE075KL  [RES-STACK-POLE-0603]  (value not drawn)
R70  DNI  [RES-STACK-POLE-0805]
R71  150  0805  [RES-STACK-POLE-0805]
R73  DNI  [RES-STACK-POLE-0805]
R74  4.99 0805  [RES-STACK-POLE-0805]
R75  DNI  [RES-STACK-POLE-0805]
R76  49.9  0805  [RES-STACK-POLE-0805]
R77  0 ohm 0805  [RES-STACK-POLE-0805]
R79  4.99 0805  [RES-STACK-POLE-0805]
R80  0 ohm 0805  [RES-STACK-POLE-0805]
R81  0 ohm 0805  [RES-STACK-POLE-0805]
R82  0 ohm 0805  [RES-STACK-POLE-0805]
R97  RMCF0603JG10K0  [RES-STACK-POLE-0603]  (value not drawn)
R98  RMCF0603JG10K0  [RES-STACK-POLE-0603]  (value not drawn)
TP29  TESTPOINT_S  [TESTPOINT_S]  (value not drawn)  (no BOM)
TP30  TESTPOINT_S  [TESTPOINT_S]  (value not drawn)  (no BOM)
TP31  TESTPOINT_S  [TESTPOINT_S]  (value not drawn)  (no BOM)
TP32  TESTPOINT_S  [TESTPOINT_S]  (value not drawn)  (no BOM)
TP33  TESTPOINT_S  [TESTPOINT_S]  (value not drawn)  (no BOM)
TP34  TESTPOINT_S  [TESTPOINT_S]  (value not drawn)  (no BOM)
TP35  TESTPOINT_S  [TESTPOINT_S]  (value not drawn)  (no BOM)
TP36  TESTPOINT_S  [TESTPOINT_S]  (value not drawn)  (no BOM)
TP37  TESTPOINT_S  [TESTPOINT_S]  (value not drawn)  (no BOM)
TP47  TESTPOINT_S  [TESTPOINT_S]  (value not drawn)  (no BOM)
TP48  TESTPOINT_S  [TESTPOINT_S]  (value not drawn)  (no BOM)
TP49  TESTPOINT_S  [TESTPOINT_S]  (value not drawn)  (no BOM)
TP50  TESTPOINT_S  [TESTPOINT_S]  (value not drawn)  (no BOM)
TP51  TESTPOINT_S  [TESTPOINT_S]  (value not drawn)  (no BOM)
TP52  TESTPOINT_S  [TESTPOINT_S]  (value not drawn)  (no BOM)
TP53  TESTPOINT_S  [TESTPOINT_S]  (value not drawn)  (no BOM)
TP57  TESTPOINT_S  [TESTPOINT_S]  (value not drawn)  (no BOM)
TP58  TESTPOINT_S  [TESTPOINT_S]  (value not drawn)  (no BOM)
TP59  TESTPOINT_S  [TESTPOINT_S]  (value not drawn)  (no BOM)
U18  Level-shifter  [SON50P100X60-6N]
U19  MAX3736  [16-TQFN-EP]
U20  Level-shifter  [SON50P100X60-6N]
U25  LMG1020  [YFF0006AEAE]
U26  AND Gate  [SOT-1.1]

### Ports
BIAS_READ (out, see 00_cover_sheet[5B]), BIASSET_LD (in, see 00_cover_sheet[5B]), IN2 (in, see 00_cover_sheet[5B]), IN+ (in, see 00_cover_sheet[5B]), IN- (in, see 00_cover_sheet[5B]), LD_START (out, see 00_cover_sheet[4A]), MODSET_LD (in, see 00_cover_sheet[5B]), TX_DIS_LD (out, see 00_cover_sheet[5B])

### Nets
0V9: C91.1 C92.1 C99.1 C100.1 U18.1(VCCA) U20.1(VCCA)
3V3D: C93.1 C94.1 C101.1 C102.1 U18.6(VCCB) U20.6(VCCB)
5V5: C121.1 C122.1 R71.2 R76.2
5V_laser: C60.1 C61.1 C68.1 C69.1 C70.1 C71.1 C72.1 C73.1 C74.1 C75.1 C95.1 C124.1 C125.1 C129.1(IN/OUT) C130.1 L2.1 R57.2 R59.2 U19.1(VCC) U19.4(VCC) U19.9(VCC) U19.12(VCC) U19.15(VCC) U26.5(VCC)
GND: C60.2 C61.2 C68.2 C69.2 C70.2 C71.2 C72.2 C73.2 C74.2 C75.2 C91.2 C92.2 C93.2 C94.2 C95.2 C96.1 C98.2 C99.2 C100.2 C101.2 C102.2 C103.2 C105.2 C121.2 C122.2 C124.2 C125.2 C129.3(GND) C130.2 Q1.2 Q1.4 Q1.6 Q1.7 R58.1 R64.1 R65.1 R66.1 R97.1 R98.1 TP31.1 TP34.1 TP37.1 TP53.1 TP57.1 TP59.1 U18.2(GND) U19.13(GND) U19.14(GND) U20.2(GND) U25.3(GND) U25.6(IN-) U26.3(GND)
0V9_IN+: C97.1 U18.3(A)
0V9_IN-: C104.1 U20.3(A)
anode: L2.2 LD1.2 LD1.3 R61.2 R64.2 R71.1 TP35.1
cathode: L3.1 LD1.1 R62.2 R76.1 R77.2 TP51.1
gate: Q1.1 R74.2 R79.2 TP50.1
LD_path1: R70.2 TP48.1 U18.4(B)
LD_path2: R73.2 R75.1 R80.2 TP49.1
NetC96_2: C96.2 R60.2
NetC97_2: C97.2 R57.1 R58.2 TP29.1 U19.2(IN+)
NetC98_1: C98.1 R63.1
NetC103_1: C103.1 R68.2 TP32.1 ; port BIASSET_LD
NetC104_2: C104.2 R59.1 R66.2 TP30.1 U19.3(IN-)
NetC105_1: C105.1 R69.2 TP33.1 ; port MODSET_LD
NetC110_1: C110.1 U19.10(OUT+)
NetC110_2: C110.2 R62.1 R63.2
NetC129_2: C129.2(OUT/IN) U25.1(VDD)
NetL3_2: L3.2 TP36.1 U19.8(BIAS)
NetQ1_3: Q1.3 Q1.5 R77.1
NetR60_1: R60.1 R61.1 U19.11(OUT-)
NetR65_2: R65.2 U19.7(BC_MON) ; port BIAS_READ
NetR67_1: R67.1 U20.4(B)
NetR67_2: R67.2 TP47.1 ; port IN-
NetR68_1: R68.1 U19.5(BIASSET)
NetR69_1: R69.1 U19.6(MODSET)
NetR70_1: R70.1 R73.1 ; port IN+, port LD_START
NetR74_1: R74.1 U25.2(OUTH)
NetR75_2: R75.2 R81.2 TP52.1 U25.5(IN+)
NetR79_1: R79.1 U25.4(OUTL)
NetR80_1: R80.1 U26.1(A)
NetR81_1: R81.1 U26.4(Y)
NetR82_1: R82.1 TP58.1 ; port IN2
NetR82_2: R82.2 U26.2(B)
NetR97_2: R97.2 U18.5(DIR)
NetR98_2: R98.2 U20.5(DIR)
NetU17_45: U19.16(DIS) ; port TX_DIS_LD

Not connected (* = marked no-connect by the designer): U19 17(EPAD)

### Notes on the sheet
- ACCORDING TO THE EVAL  BOARD ! -- ASK ABOUT CD !
- 110ohm and 20pF is more suitable
- According to the eval board -- should i place a cap ?
- IN+ =  TIM1 PWM
- IN- =  TIM1 PWMn
- IN2 =  another TIM channel
- total delay from mcu to all those should be equal to eachother
- (near R71) DACoutput = VREF x (DOR/4096)
- FET pin2 is Kelvin ground??
- (in symbol C0603C103J5RACTU) 0.01u; 0603
- (in symbol C0603C221K5RAC7867) 220p; 0603
- (in symbol C1608X5R1E105K080AC) 1u; 0603
- (in symbol CGA3E2X7R1H104K080AA) 0.1u; 0603
- (in symbol EPC2019) SUB
- (in symbol RMCF0603FT2K21) 0603; 2.21K
- (in symbol RMCF0603JG10K0) 10K; 0603
- (in symbol RT0603BRE075KL) 0603; 5K

### Library data of the parts
C60 C68 C70 C72 C74 C91 C94 C99 C102 C130 = C1608X5R1E105K080AC: CAP CER 1UF 25V X5R 0603; Supplier 1: Digi-Key; Supplier Part Number 1: 445-5146-1-ND
C61 C69 C71 C73 C75 C92 C93 C97 C100 C101 C104 C122 C125 = CGA3E2X7R1H104K080AA: CAP CER 0.1UF 50V X7R 0603; Supplier 1: Digi-Key; Supplier Part Number 1: 445-5666-1-ND
C95 C103 C105 C110 = C0402_PROVISION: CAP PROVISION 0603; Value: DNI
C96 C98 = C0603C221K5RAC7867: CAP CER 220PF 50V X7R 0603; Supplier 1: Digikey; Supplier Part Number 1: 399-C0603C221K5RAC7867CT-ND
C121 = C0603C103J5RACTU: CAP CER 10000PF 50V X7R 0603; Supplier 1: Digikey; Supplier Part Number 1: 399-C0603C103J5RACTUCT-ND
C124 = CAP2u2: CAP CER 2.2UF 0603; Supplier 1: Digi-Key; Supplier Part Number 1: 445-5146-1-ND
C129 = YFF18PW0J474MT0H0N: YFF18PW0J474MT0H0N CAP FEEDTHRU 0.47UF 6.3V 0603; Supplier 1: Digikey; Supplier Part Number 1: 445-3028-1-ND
L2 L3 = MMZ1608Q102BTD25: FERRITE BEAD 1K OHM 0603 1LN; Supplier 1: Digikey; Supplier Part Number 1: 445-MMZ1608Q102BTD25CT-ND
LD1 = LA_LS56HB: Hyper Blue Laser Diode (450 nm), Single Modeligh tavenue / - 80 mW optical power / - Low threshold / - 5.6 mm TO package / - Medium power; Supplier 1: Light Avenue; Supplier Part Number 1: LA_LS56HB
Q1 = EPC2019: GANFET N-CH 200V 8.5A DIE N-Channel 200 V 8.5A (Ta) Surface Mount Die; Supplier 1: Digikey; Supplier Part Number 1: 917-1087-1-ND
R57-R59 R64 = RK73H2ATTD1001F: RES 1K OHM 1% 1/4W 0805; Supplier 1: Digikey; Supplier Part Number 1: 2019-RK73H2ATTD1001FCT-ND
R60 = RK73H2ATTD75R0F: RES 75 OHM 1% 1/4W 0805; Supplier 1: Digikey; Supplier Part Number 1: 2019-RK73H2ATTD75R0FCT-ND
R61 = RK73H2ATTD15R0F: RES 15 OHM 1% 1/4W 0805; Supplier 1: Digikey; Supplier Part Number 1: 2019-RK73H2ATTD15R0FCT-ND
R62 = RK73H2ATTD10R0F: RES 10 OHM 1% 1/4W 0805; Supplier 1: Digikey; Supplier Part Number 1: 2019-RK73H2ATTD10R0FCT-ND
R63 = RK73H2ATTD24R0F: RES 24 OHM 1% 1/4W 0805; Supplier 1: Digikey; Supplier Part Number 1: 2019-RK73H2ATTD24R0FCT-ND
R65 = RK73H2AT1001F: RK73H2ATK001KIT %1 tolerance resistors 0805
R66 = RK73H2ATTD2321F: RES 2.32K OHM 1% 1/4W 0805; Supplier 1: Digikey; Supplier Part Number 1: 541-2.32KHCT-ND
R67 R77 R80-R82 = RC0805JR-070RL: RES 0 OHM JUMPER 1/8W 0805; Supplier 1: Digikey; Supplier Part Number 1: 311-0.0ARCT-ND
R68 = RMCF0603FT2K21: RES 2.21K OHM 0.1% 1/10W 0603; Supplier 1: Digikey; Supplier Part Number 1: RMCF0603FT2K21CT-ND
R69 = RT0603BRE075KL: RES 5K OHM 0.1% 1/10W 0603; Supplier 1: Digikey; Supplier Part Number 1: 13-RT0603BRE075KLCT-ND
R70 R73 R75 = R0805: RES DNI 0805
R71 = RK73H2ATTD1500F: RES 150 OHM 1% 1/4W 0805; Supplier 1: Digikey; Supplier Part Number 1: 2019-RK73H2ATTD1500FCT-ND
R74 R79 = RK73H2ATTD4R99F: RES 4.99 OHM 1% 1/4W 0805; Supplier 1: Digikey; Supplier Part Number 1: 2019-RK73H2ATTD4R99FCT-ND
R76 = RK73H2ATTD49R9F: RES 49.9 OHM 1% 1/4W 0805; Supplier 1: Digikey; Supplier Part Number 1: 2019-RK73H2ATTD49R9FCT-ND
R97 R98 = RMCF0603JG10K0: RES 10K OHM 5% 1/10W 0603; Supplier 1: Digi-Key; Supplier Part Number 1: 738-RMCF0603JG10K0CT-ND
TP29-TP37 TP47-TP53 TP57-TP59 = TESTPOINT_S: Testpoint Surface Pad
U18 U20 = SN74AXCH1T45DRY2: as U8 on sheet 01_detection; Supplier 1: Digikey; Supplier Part Number 1: 296-SN74AXCH1T45DRY2CT-ND
U19 = MAX3736: IC LASER DRVR 3.2GB 3.63V 16TQFN; Supplier 1: Digikey; Supplier Part Number 1: 175-MAX3736ETE+TCT-ND
U25 = LMG1020YFFR: IC GATE DRVR LOW-SIDE 6DSBGA; Supplier 1: Digikey; Supplier Part Number 1: 296-50208-1-ND
U26 = SN74LVC1G08DCKR: IC GATE AND 1CH 2-INP SC70-5; Supplier 1: Digikey; Supplier Part Number 1: 296-35941-1-ND

## Sheet 03_mcu.SchDoc
size B; SheetNumber: 5; SheetTotal: 17
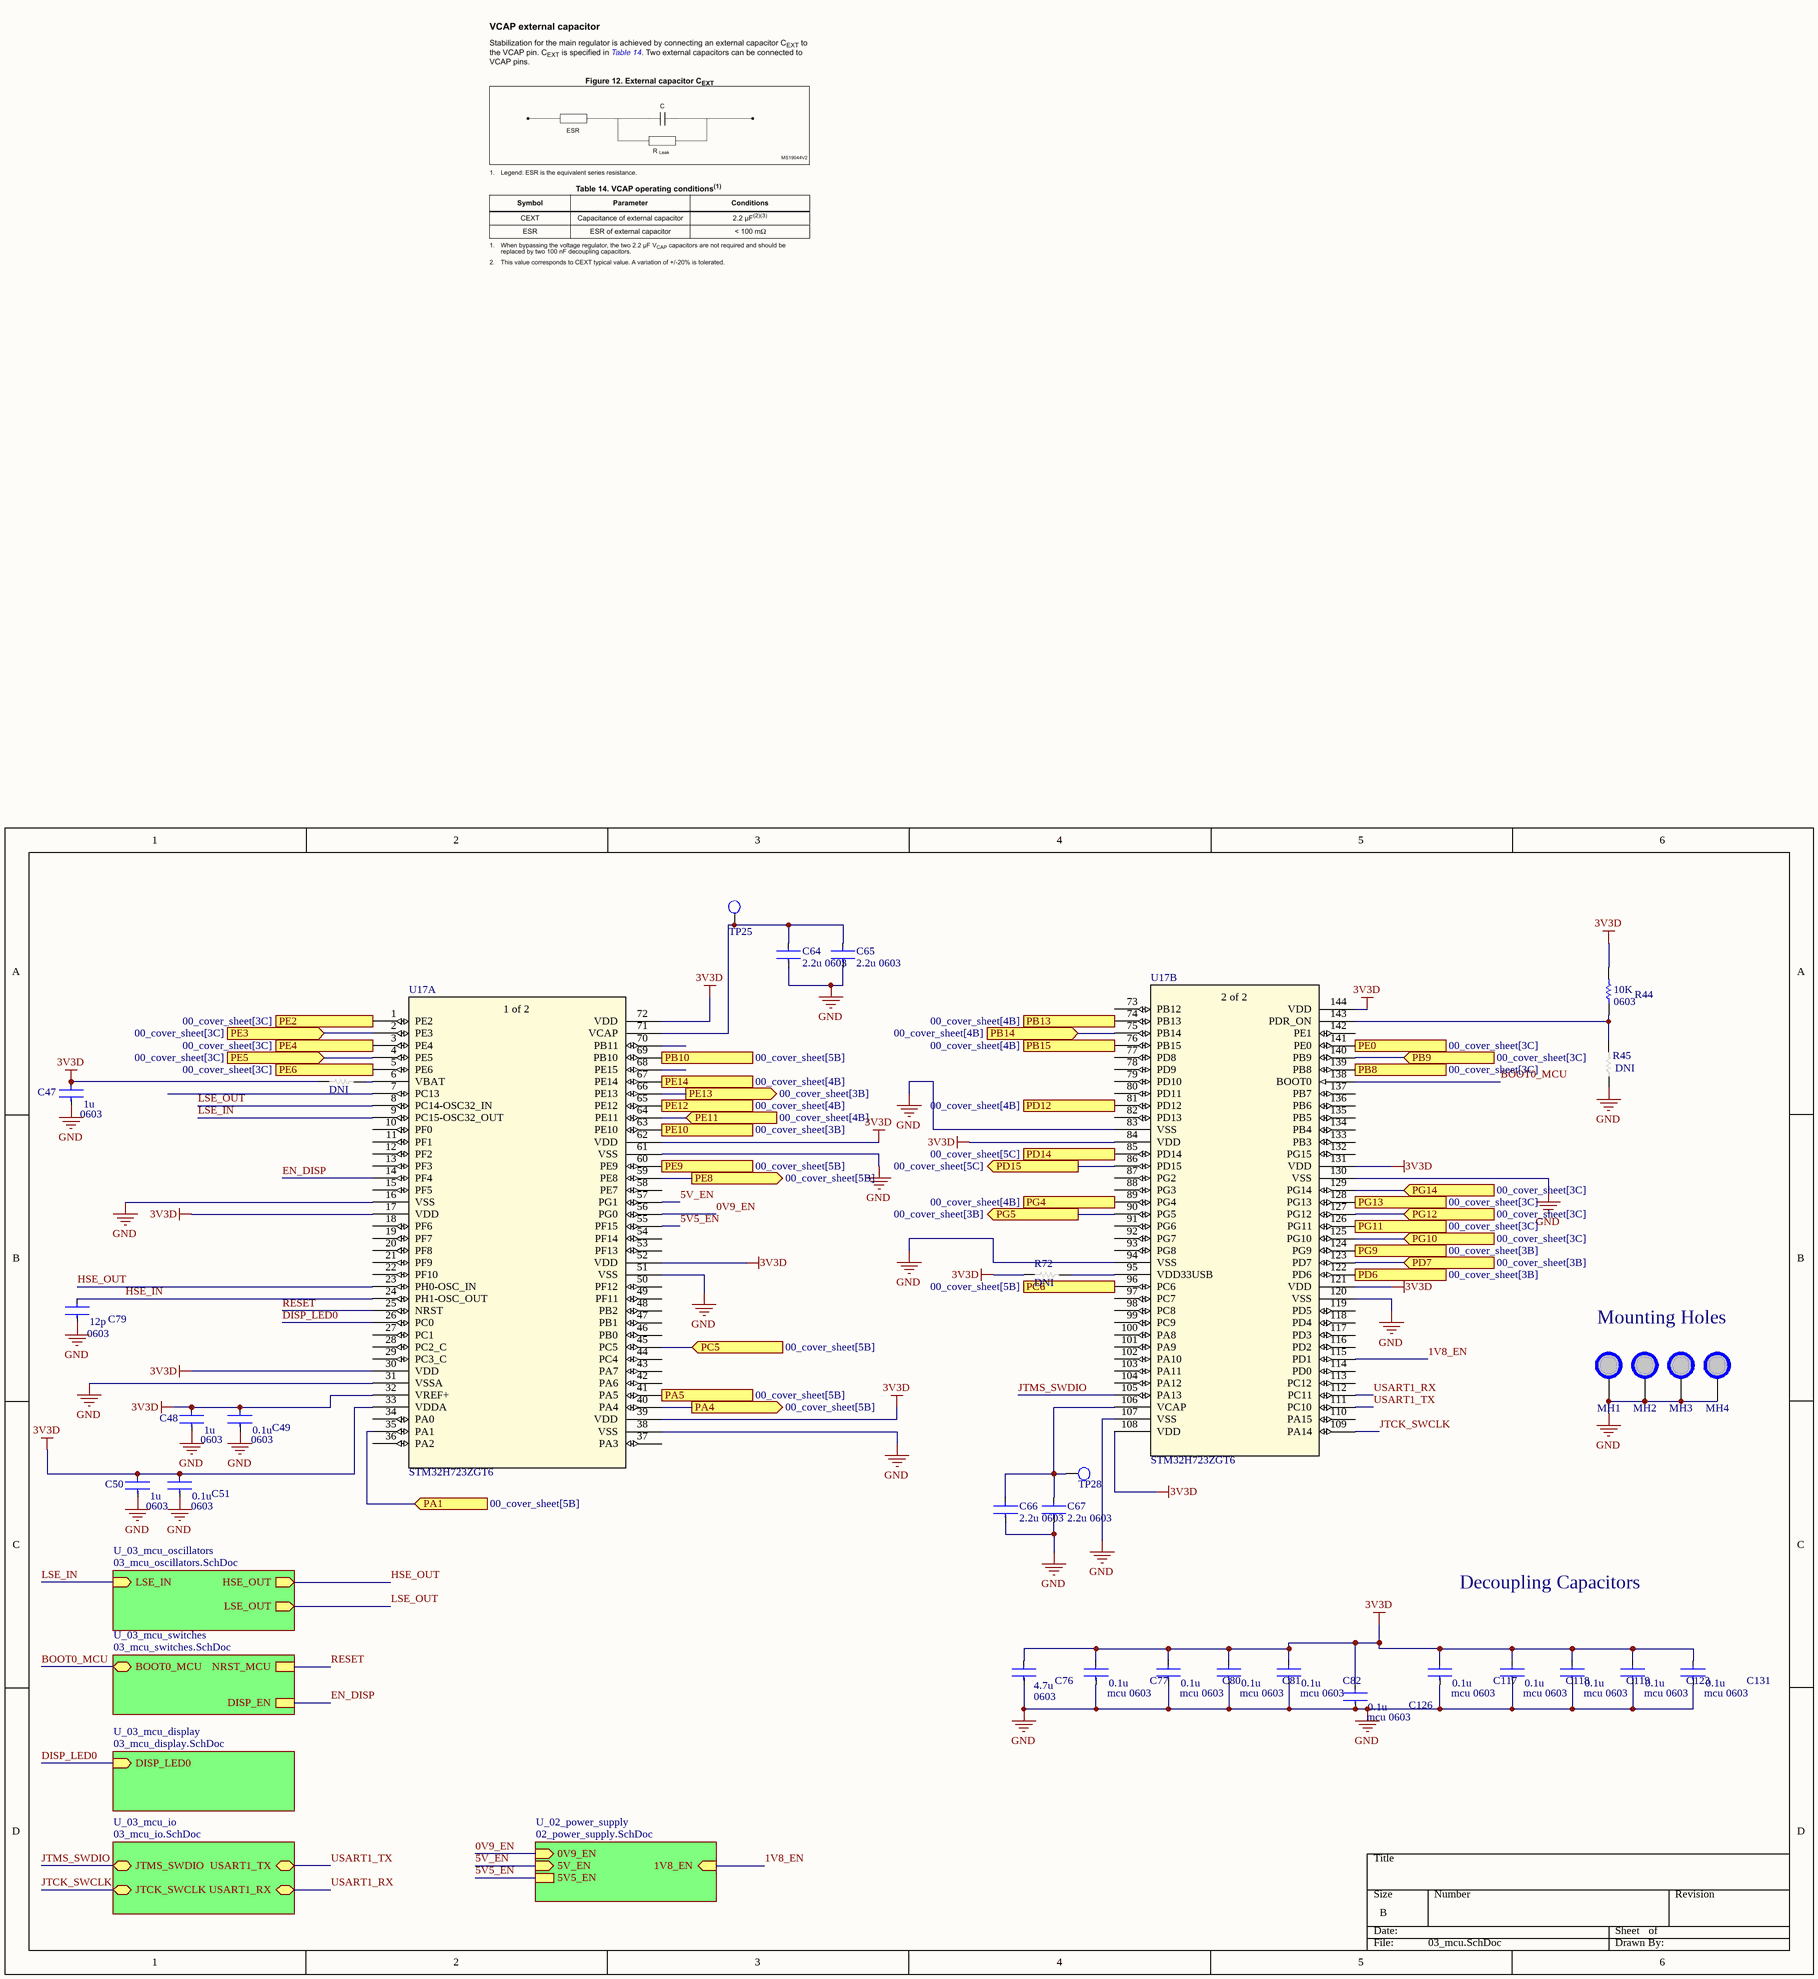
[diagram p5: 03_mcu.SchDoc]

### Parts
C47  C1608X5R1E105K080AC  [CAPTDK0603]  (value not drawn)
C48  C1608X5R1E105K080AC  [CAPTDK0603]  (value not drawn)
C49  CGA3E2X7R1H104K080AA  [CAPTDK0603]  (value not drawn)
C50  C1608X5R1E105K080AC  [CAPTDK0603]  (value not drawn)
C51  CGA3E2X7R1H104K080AA  [CAPTDK0603]  (value not drawn)
C64  2.2u 0603  [CAPTDK0603]
C65  2.2u 0603  [CAPTDK0603]
C66  2.2u 0603  [CAPTDK0603]
C67  2.2u 0603  [CAPTDK0603]
C76  C1608X5R1E475K080AC  [CAPTDK0603]  (value not drawn)
C77  NMC0603X7R104K50TRPF  [CAPTDK0603]  (value not drawn)
C79  CGA3E2C0G1H120J080AA  [CAPTDK0603]  (value not drawn)
C80  NMC0603X7R104K50TRPF  [CAPTDK0603]  (value not drawn)
C81  NMC0603X7R104K50TRPF  [CAPTDK0603]  (value not drawn)
C82  NMC0603X7R104K50TRPF  [CAPTDK0603]  (value not drawn)
C117  NMC0603X7R104K50TRPF  [CAPTDK0603]  (value not drawn)
C118  NMC0603X7R104K50TRPF  [CAPTDK0603]  (value not drawn)
C119  NMC0603X7R104K50TRPF  [CAPTDK0603]  (value not drawn)
C123  NMC0603X7R104K50TRPF  [CAPTDK0603]  (value not drawn)
C126  NMC0603X7R104K50TRPF  [CAPTDK0603]  (value not drawn)
C131  NMC0603X7R104K50TRPF  [CAPTDK0603]  (value not drawn)
MH1  M3.5 Mounting Hole  [M3.5 Mounting Hole - Supported]  (value not drawn)  (no BOM)
MH2  M3.5 Mounting Hole  [M3.5 Mounting Hole - Supported]  (value not drawn)  (no BOM)
MH3  M3.5 Mounting Hole  [M3.5 Mounting Hole - Supported]  (value not drawn)  (no BOM)
MH4  M3.5 Mounting Hole  [M3.5 Mounting Hole - Supported]  (value not drawn)  (no BOM)
R44  RMCF0603JG10K0  [RES-STACK-POLE-0603]  (value not drawn)
R45  DNI  [RES_0603]
R46  DNI  [RES_0603]
R72  DNI  [RES_0603]
TP25  TESTPOINT_S  [TESTPOINT_S]  (value not drawn)  (no BOM)
TP28  TESTPOINT_S  [TESTPOINT_S]  (value not drawn)  (no BOM)
U17  STM32H723ZGT6  [LQFP144]  (parts A,B of 2)

### Sub-sheets
U_02_power_supply = 02_power_supply.SchDoc: 1V8_EN (in), 0V9_EN (in), 5V_EN (in), 5V5_EN
U_03_mcu_display = 03_mcu_display.SchDoc: DISP_LED0 (in)
U_03_mcu_io = 03_mcu_io.SchDoc: USART1_TX (bidir), USART1_RX (bidir), JTMS_SWDIO (bidir), JTCK_SWCLK (bidir)
U_03_mcu_oscillators = 03_mcu_oscillators.SchDoc: HSE_OUT (out), LSE_IN (in), LSE_OUT (out)
U_03_mcu_switches = 03_mcu_switches.SchDoc: BOOT0_MCU (bidir), NRST_MCU, DISP_EN

### Ports
PA1 (in, see 00_cover_sheet[5B]), PA4 (out, see 00_cover_sheet[5B]), PA5 (out, see 00_cover_sheet[5B]), PB8 (in, see 00_cover_sheet[3C]), PB9 (in, see 00_cover_sheet[3C]), PB10 (out, see 00_cover_sheet[5B]), PB13 (out, see 00_cover_sheet[4B]), PB14 (in, see 00_cover_sheet[4B]), PB15 (out, see 00_cover_sheet[4B]), PC5 (in, see 00_cover_sheet[5B]), PC6 (out, see 00_cover_sheet[5B]), PD6 (in, see 00_cover_sheet[3B]), PD7 (in, see 00_cover_sheet[3B]), PD12 (out, see 00_cover_sheet[4B]), PD14 (in, see 00_cover_sheet[5C]), PD15 (out, see 00_cover_sheet[5C]), PE0 (in, see 00_cover_sheet[3C]), PE2 (in, see 00_cover_sheet[3C]), PE3 (in, see 00_cover_sheet[3C]), PE4 (in, see 00_cover_sheet[3C]), PE5 (in, see 00_cover_sheet[3C]), PE6 (in, see 00_cover_sheet[3C]), PE8 (out, see 00_cover_sheet[5B]), PE9 (out, see 00_cover_sheet[5B]), PE10 (out, see 00_cover_sheet[3B]), PE11 (in, see 00_cover_sheet[4B]), PE12 (in, see 00_cover_sheet[4B]), PE13 (out, see 00_cover_sheet[3B]), PE14 (in, see 00_cover_sheet[4B]), PG4 (in, see 00_cover_sheet[4B]), PG5 (out, see 00_cover_sheet[3B]), PG9 (in, see 00_cover_sheet[3B]), PG10 (in, see 00_cover_sheet[3C]), PG11 (in, see 00_cover_sheet[3C]), PG12 (in, see 00_cover_sheet[3C]), PG13 (in, see 00_cover_sheet[3C]), PG14 (in, see 00_cover_sheet[3C])

### Nets
3V3D: C47.1 C48.1 C49.1 C50.1 C51.1 C76.1 C77.1 C80.1 C81.1 C82.1 C117.1 C118.1 C119.1 C123.1 C126.1 C131.1 R44.2 R46.1 R72.1 U17.17(VDD) U17.30(VDD) U17.32(VREF+) U17.33(VDDA) U17.39(VDD) U17.52(VDD) U17.62(VDD) U17.72(VDD) U17.84(VDD) U17.108(VDD) U17.121(VDD) U17.131(VDD) U17.144(VDD)
GND: C47.2 C48.2 C49.2 C50.2 C51.2 C64.2 C65.2 C66.2 C67.2 C76.2 C77.2 C79.2 C80.2 C81.2 C82.2 C117.2 C118.2 C119.2 C123.2 C126.2 C131.2 MH1.1 MH2.1 MH3.1 MH4.1 R45.1 U17.16(VSS) U17.31(VSSA) U17.38(VSS) U17.51(VSS) U17.61(VSS) U17.83(VSS) U17.94(VSS) U17.107(VSS) U17.120(VSS) U17.130(VSS)
0V9_EN: U17.56(PG0) ; sheet U_02_power_supply/0V9_EN
1V8_EN: U17.115(PD1) ; sheet U_02_power_supply/1V8_EN
5V5_EN: U17.55(PF15) ; sheet U_02_power_supply/5V5_EN
5V_EN: U17.57(PG1) ; sheet U_02_power_supply/5V_EN
BOOT0_MCU: U17.138(BOOT0) ; sheet U_03_mcu_switches/BOOT0_MCU
Counter_1_BIT_0: U17.122(PD6) ; port PD6
Counter_1_BIT_1: U17.123(PD7) ; port PD7
Counter_1_BIT_2: U17.124(PG9) ; port PG9
Counter_1_BIT_3: U17.125(PG10) ; port PG10
Counter_1_BIT_4: U17.126(PG11) ; port PG11
Counter_1_BIT_5: U17.127(PG12) ; port PG12
Counter_1_BIT_6: U17.128(PG13) ; port PG13
Counter_1_BIT_7: U17.129(PG14) ; port PG14
Counter_2_BIT_0: U17.139(PB8) ; port PB8
Counter_2_BIT_1: U17.140(PB9) ; port PB9
Counter_2_BIT_2: U17.141(PE0) ; port PE0
Counter_2_BIT_3: U17.1(PE2) ; port PE2
Counter_2_BIT_4: U17.2(PE3) ; port PE3
Counter_2_BIT_5: U17.3(PE4) ; port PE4
Counter_2_BIT_6: U17.4(PE5) ; port PE5
Counter_2_BIT_7: U17.5(PE6) ; port PE6
DISP_LED0: U17.26(PC0) ; sheet U_03_mcu_display/DISP_LED0
EN_DISP: U17.14(PF4) ; sheet U_03_mcu_switches/DISP_EN  [project net DISP_EN]
HSE_IN: C79.1 U17.24(PH1-OSC_OUT)
HSE_OUT: U17.23(PH0-OSC_IN) ; sheet U_03_mcu_oscillators/HSE_OUT
JTCK_SWCLK: U17.109(PA14) ; sheet U_03_mcu_io/JTCK_SWCLK
JTMS_SWDIO: U17.105(PA13) ; sheet U_03_mcu_io/JTMS_SWDIO
LSE_IN: U17.9(PC15-OSC32_OUT) ; sheet U_03_mcu_oscillators/LSE_IN
LSE_OUT: U17.8(PC14-OSC32_IN) ; sheet U_03_mcu_oscillators/LSE_OUT
RESET: U17.25(NRST) ; sheet U_03_mcu_switches/NRST_MCU
RXD_C11204: U17.86(PD15) ; port PD15
S_LATCH_RST: U17.96(PC6) ; port PC6
TDC_INTB1: U17.65(PE12) ; port PE12
TDC_INTB2: U17.64(PE11) ; port PE11
TDC_TRIGG1: U17.67(PE14) ; port PE14
TDC_TRIGG2: U17.89(PG4) ; port PG4
TXD_C11204: U17.85(PD14) ; port PD14
USART1_RX: U17.112(PC11) ; sheet U_03_mcu_io/USART1_RX
USART1_TX: U17.111(PC10) ; sheet U_03_mcu_io/USART1_TX
NetC64_1: C64.1 C65.1 TP25.1 U17.71(VCAP)
NetC66_1: C66.1 C67.1 TP28.1 U17.106(VCAP)
NetC103_1: U17.41(PA5) ; port PA5
NetC105_1: U17.40(PA4) ; port PA4
NetR44_1: R44.1 R45.2 U17.143(PDR_ON)
NetR46_2: R46.2 U17.6(VBAT)
NetR65_2: U17.35(PA1) ; port PA1
NetR67_2: U17.59(PE8) ; port PE8
NetR70_1: U17.60(PE9) ; port PE9
NetR72_2: R72.2 U17.95(VDD33USB)
NetR82_1: U17.69(PB10) ; port PB10
NetR88_1: U17.75(PB14) ; port PB14
NetR90_1: U17.63(PE10) ; port PE10
NetR92_1: U17.76(PB15) ; port PB15
NetR93_1: U17.74(PB13) ; port PB13
NetR94_1: U17.66(PE13) ; port PE13
NetR95_1: U17.90(PG5) ; port PG5
NetTP39_1: U17.81(PD12) ; port PD12
NetU17_45: U17.45(PC5) ; port PC5

Not connected (* = marked no-connect by the designer): U17 7(PC13) 10(PF0) 11(PF1) 12(PF2) 13(PF3) 15(PF5) 18(PF6) 19(PF7) 20(PF8) 21(PF9) 22(PF10) 27(PC1) 28(PC2_C) 29(PC3_C) 34(PA0) 36(PA2) 37(PA3) 42(PA6) 43(PA7) 44(PC4) 46(PB0) 47(PB1) 48(PB2) 49(PF11) 50(PF12) 53(PF13) 54(PF14) 58(PE7) 68(PE15) 70(PB11) 73(PB12) 77(PD8) 78(PD9) 79(PD10) 80(PD11) 82(PD13) 87(PG2) 88(PG3) 91(PG6) 92(PG7) 93(PG8) 97(PC7) 98(PC8) 99(PC9) 100(PA8) 101(PA9) 102(PA10) 103(PA11) 104(PA12) 110(PA15) 113(PC12) 114(PD0) 116(PD2) 117(PD3) 118(PD4) 119(PD5) 132(PG15) 133(PB3) 134(PB4) 135(PB5) 136(PB6) 137(PB7) 142(PE1)

### Notes on the sheet
- Mounting Holes
- Decoupling Capacitors
- (in symbol C1608X5R1E105K080AC) 1u; 0603
- (in symbol C1608X5R1E475K080AC) 4.7u; 0603
- (in symbol CGA3E2C0G1H120J080AA) 12p; 0603
- (in symbol CGA3E2X7R1H104K080AA) 0.1u; 0603
- (in symbol NMC0603X7R104K50TRPF) 0.1u; mcu 0603
- (in symbol RMCF0603JG10K0) 10K; 0603
- (in symbol STM32H723ZGT6, part A) 1 of 2
- (in symbol STM32H723ZGT6, part B) 2 of 2

### Library data of the parts
C47 C48 C50 = C1608X5R1E105K080AC: CAP CER 1UF 25V X5R 0603; Supplier 1: Digi-Key; Supplier Part Number 1: 445-5146-1-ND
C49 C51 = CGA3E2X7R1H104K080AA: CAP CER 0.1UF 50V X7R 0603; Supplier 1: Digi-Key; Supplier Part Number 1: 445-5666-1-ND
C64-C67 = C1608X5R1E225K080AB: CAP CER 2.2UF 25V X5R 0603; Supplier 1: Digikey; Supplier Part Number 1: 445-5964-1-ND
C76 = C1608X5R1E475K080AC: CAP CER 4.7UF 25V X5R 0603; Supplier 1: Digi-Key; Supplier Part Number 1: 445-9050-1-ND
C77 C80-C82 C117-C119 C123 C126 C131 = NMC0603X7R104K50TRPF: 0.1 µF ±10% 50V Ceramic Capacitor X7R 0603 (1608 Metric) low esr mcu caps; Supplier 1: Digikey; Supplier Part Number 1: 4988-NMC0603X7R104K50TRPFCT-ND
C79 = CGA3E2C0G1H120J080AA: CAP CER 12PF 50V C0G 0603; Supplier 1: Digi-Key; Supplier Part Number 1: 445-5629-1-ND
R44 = RMCF0603JG10K0: RES 10K OHM 5% 1/10W 0603; Supplier 1: Digi-Key; Supplier Part Number 1: 738-RMCF0603JG10K0CT-ND
R45 R46 R72 = R0603: RES DNI 0603
TP25 TP28 = TESTPOINT_S: Testpoint Surface Pad
U17 = STM32H723ZGT6: No Description Available; Mfr_Name: STMicroelectronics; Copyright: Copyright (C) 2024 Ultra Librarian. All rights reserved.; Manufacturer_Part_Number: STM32H723ZGT6; RefDes: RefDes; Type: DEV; Supplier 1: Digikey; Supplier Part Number 1: 497-STM32H723ZGT6-ND
MH1-MH4 = M3.5 Mounting Hole: Published: 8-Jun-2000; LatestRevisionDate: 17-Jul-2002; LatestRevisionNote: Re-released for DXP Platform.; PackageReference: RAD-0.3; Publisher: Altium Limited; PackageDescription: Radial Cap, Thru-Hole; 2 Leads; 0.3 in Pin Spacing

## Sheet 03_mcu_oscillators.SchDoc
size A; SheetNumber: 12; SheetTotal: 17
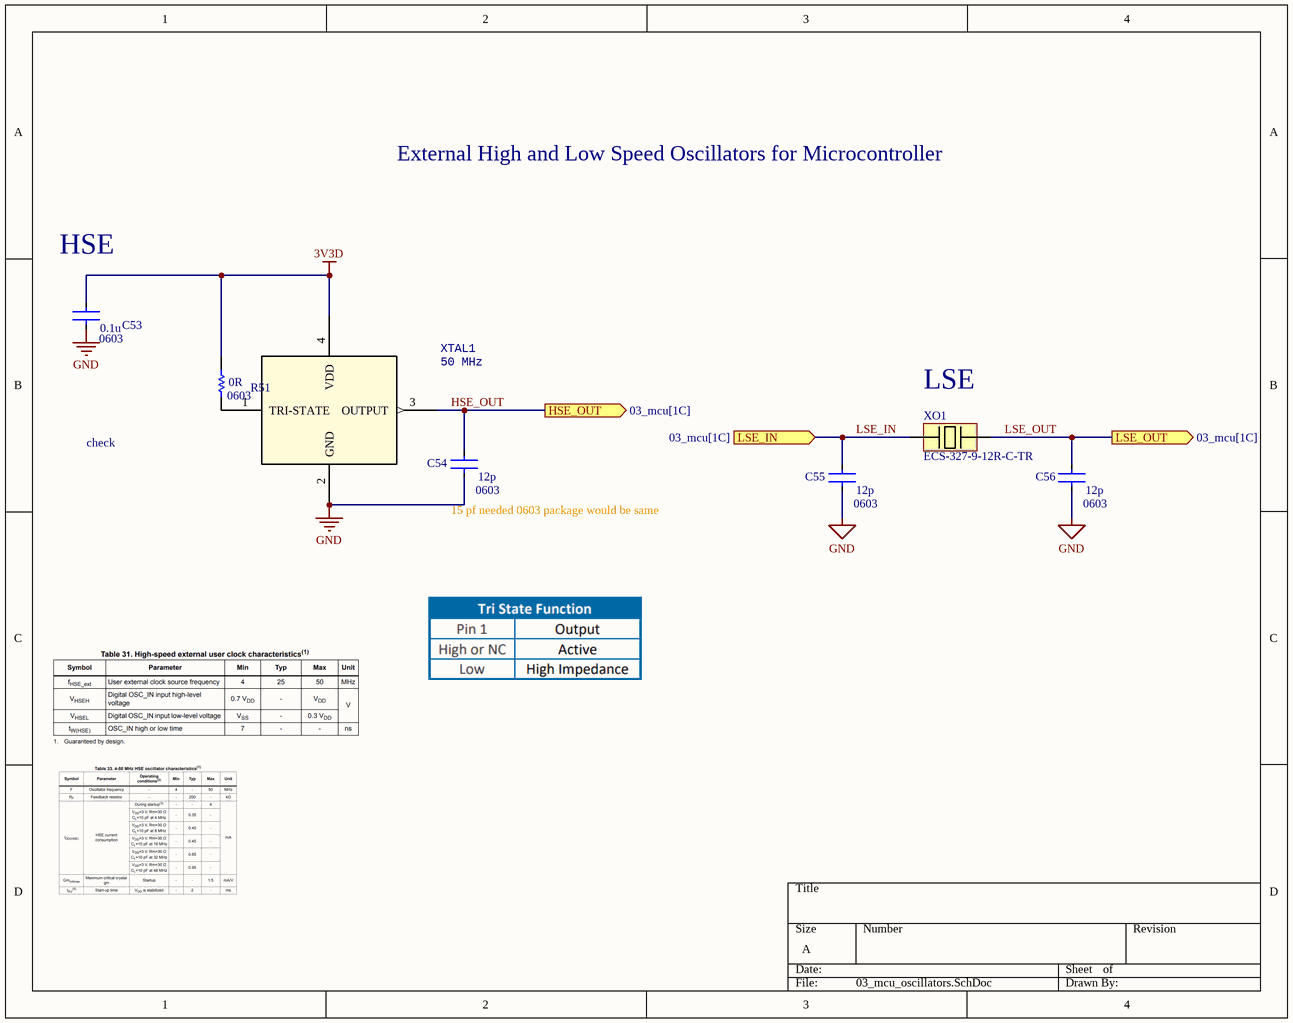
[diagram p6: 03_mcu_oscillators.SchDoc]

### Parts
C53  CGA3E2X7R1H104K080AA  [CAPTDK0603]  (value not drawn)
C54  CGA3E2C0G1H120J080AA  [CAPTDK0603]  (value not drawn)
C55  CGA3E2C0G1H120J080AA  [CAPTDK0603]  (value not drawn)
C56  CGA3E2C0G1H120J080AA  [CAPTDK0603]  (value not drawn)
R51  RMCF0603ZT0R00  [RES-STACK-POLE-0603]  (value not drawn)
XO1  ECS-327-9-12R-C-TR  [LSE-32K]
XTAL1  50 MHz  [ECS-2520S]

### Ports
HSE_OUT (out, see 03_mcu[1C]), LSE_IN (in, see 03_mcu[1C]), LSE_OUT (out, see 03_mcu[1C])

### Nets
3V3D: C53.1 R51.2 XTAL1.4(VDD)
GND: C53.2 C54.2 C55.2 C56.2 XTAL1.2(GND)
HSE_OUT: C54.1 XTAL1.3(OUTPUT) ; port HSE_OUT
LSE_IN: C55.1 XO1.1 ; port LSE_IN
LSE_OUT: C56.1 XO1.2 ; port LSE_OUT
NetR51_1: R51.1 XTAL1.1(TRI-STATE)

### Notes on the sheet
- External High and Low Speed Oscillators for Microcontroller
- (near C53) HSE
- (near XO1) LSE
- check
- (near C54) 15 pf needed 0603 package would be same
- (in symbol CGA3E2C0G1H120J080AA) 12p; 0603
- (in symbol CGA3E2X7R1H104K080AA) 0.1u; 0603
- (in symbol RMCF0603ZT0R00) 0R; 0603

### Library data of the parts
C53 = CGA3E2X7R1H104K080AA: CAP CER 0.1UF 50V X7R 0603; Supplier 1: Digi-Key; Supplier Part Number 1: 445-5666-1-ND
C54-C56 = CGA3E2C0G1H120J080AA: CAP CER 12PF 50V C0G 0603; Supplier 1: Digi-Key; Supplier Part Number 1: 445-5629-1-ND
R51 = RMCF0603ZT0R00: RES 0 OHM JUMPER 1/10W 0603; Supplier 1: Digi-Key; Supplier Part Number 1: RMCF0603ZT0R00CT-ND
XO1 = ECS-327-9-12R-C-TR: Crystal 0.032768MHz ±10ppm (Tol) 9pF Flexural 70000Ohm Automotive 2-Pin Ultra Mini-CSMD T/R; Manufacturer: ECS International; Manufacturer Part Number: ECS-.327-9-12R-C-TR; Frequency: 32.768kHz; ESR (Equivalent Series Resistance): 70kR; Supplier 1: Digi-Key; RoHS: Yes; Stock 1: 152; Pricing 1: 1=0.79000, 10=0.65700, 50=0.59160, 100=0.52580, 500=0.49952, 1000=0.42064 (USD); Mount: Surface Mount; Case/Package: SMD/SMT; Min Operating Temperature: -40°C; Max Operating Temperature: 85°C; Packaging: Tape and Reel; Frequency Tolerance: 10ppm; Load Capacitance: 9pF; ComponentLink1URL: https://www.ecsxtal.com/store/pdf/ECX-12R.pdf?src-supplier=Digi-Key; ComponentLink1Description: https://www.ecsxtal.com/store/pdf/ECX-12R.pdf?src-supplier=Digi-Key; Supplier Part Number 1: XC2744CT-ND
XTAL1 = ECS-2520S33-500-FN-TR: XTAL OSC XO 50.0000MHZ HCMOS SMD; Supplier 1: Digikey; Supplier Part Number 1: XC2202CT-ND

## Sheet 03_mcu_switches.SchDoc
size A; SheetNumber: 13; SheetTotal: 17
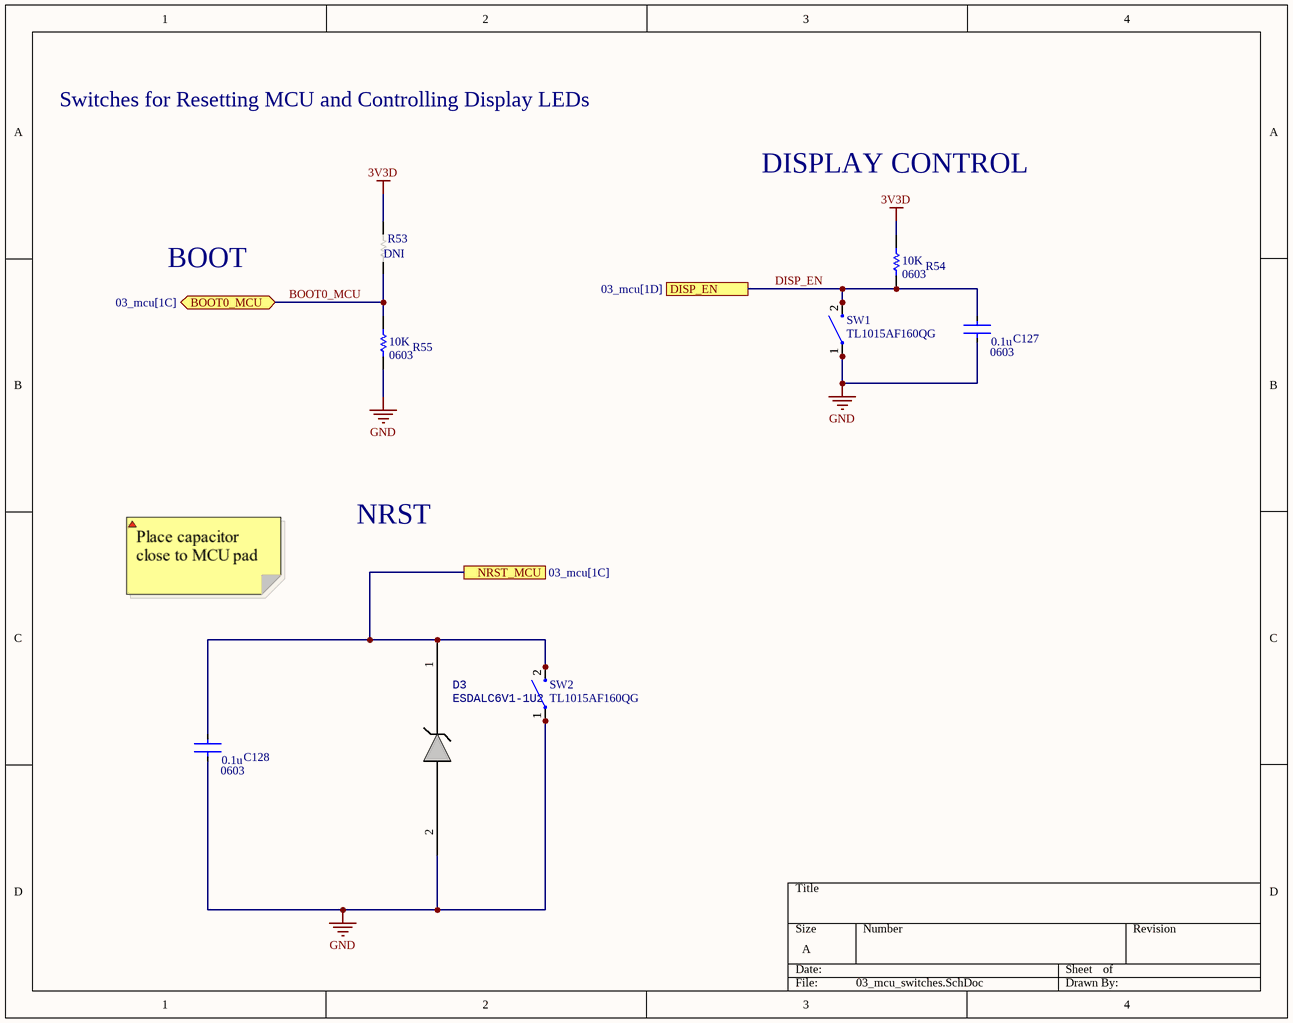
[diagram p7: 03_mcu_switches.SchDoc]

### Parts
C127  CGA3E2X7R1H104K080AA  [CAPTDK0603]  (value not drawn)
C128  CGA3E2X7R1H104K080AA  [CAPTDK0603]  (value not drawn)
D3  ESDALC6V1-1U2  [DIODE_ESDALC6V1-1U2_STM]
R53  DNI  [RES_0603]
R54  RMCF0603JG10K0  [RES-STACK-POLE-0603]  (value not drawn)
R55  RMCF0603JG10K0  [RES-STACK-POLE-0603]  (value not drawn)
SW1  TL1015AF160QG  [TACTILE-SWITCH]
SW2  TL1015AF160QG  [TACTILE-SWITCH]

### Ports
BOOT0_MCU (bidir, see 03_mcu[1C]), DISP_EN (see 03_mcu[1D]), NRST_MCU (see 03_mcu[1C])

### Nets
3V3D: R53.2 R54.2
GND: C127.2 C128.2 D3.2 R55.1 SW1.1 SW2.1
BOOT0_MCU: R53.1 R55.2 ; port BOOT0_MCU
DISP_EN: C127.1 R54.1 SW1.2 ; port DISP_EN
RESET: C128.1 D3.1 SW2.2 ; port NRST_MCU

### Notes on the sheet
- Switches for Resetting MCU and Controlling Display LEDs
- DISPLAY CONTROL
- BOOT
- NRST
- (in symbol CGA3E2X7R1H104K080AA) 0.1u; 0603
- (in symbol RMCF0603JG10K0) 10K; 0603

### Library data of the parts
C127 C128 = CGA3E2X7R1H104K080AA: CAP CER 0.1UF 50V X7R 0603; Supplier 1: Digi-Key; Supplier Part Number 1: 445-5666-1-ND
D3 = ESDALC6V1: TVS DIODE 3VWM ST0201; Supplier 1: Digikey; Supplier Part Number 1: 497-8752-1-ND
R53 = R0603: RES DNI 0603
R54 R55 = RMCF0603JG10K0: RES 10K OHM 5% 1/10W 0603; Supplier 1: Digi-Key; Supplier Part Number 1: 738-RMCF0603JG10K0CT-ND
SW1 SW2 = TL1015AF160QG: SWITCH TACTILE SPST-NO 0.05A 12V; Supplier 1: Digi-Key; Supplier Part Number 1: EG4344CT-ND